# EAGLE design shield_bigfpga (EAGLE 9.1.1)
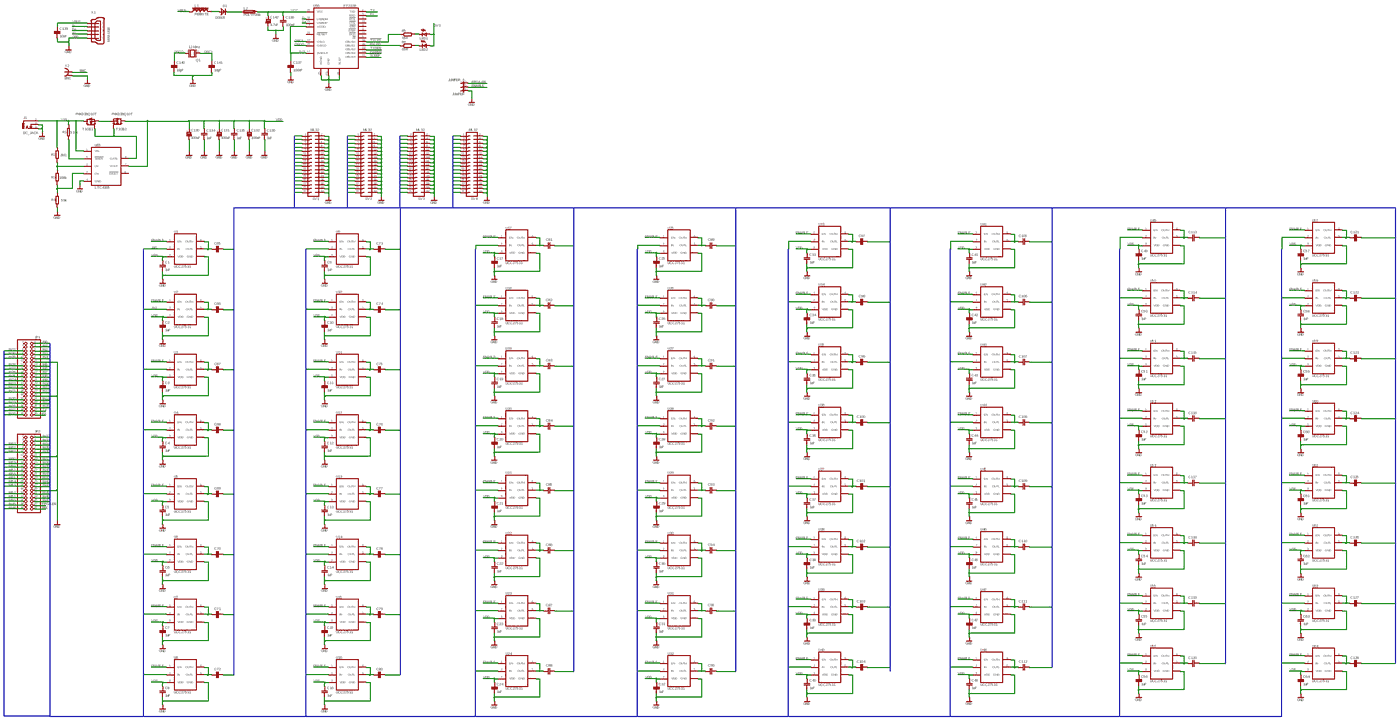
[diagram p0: schematic, sheet 1, overview]
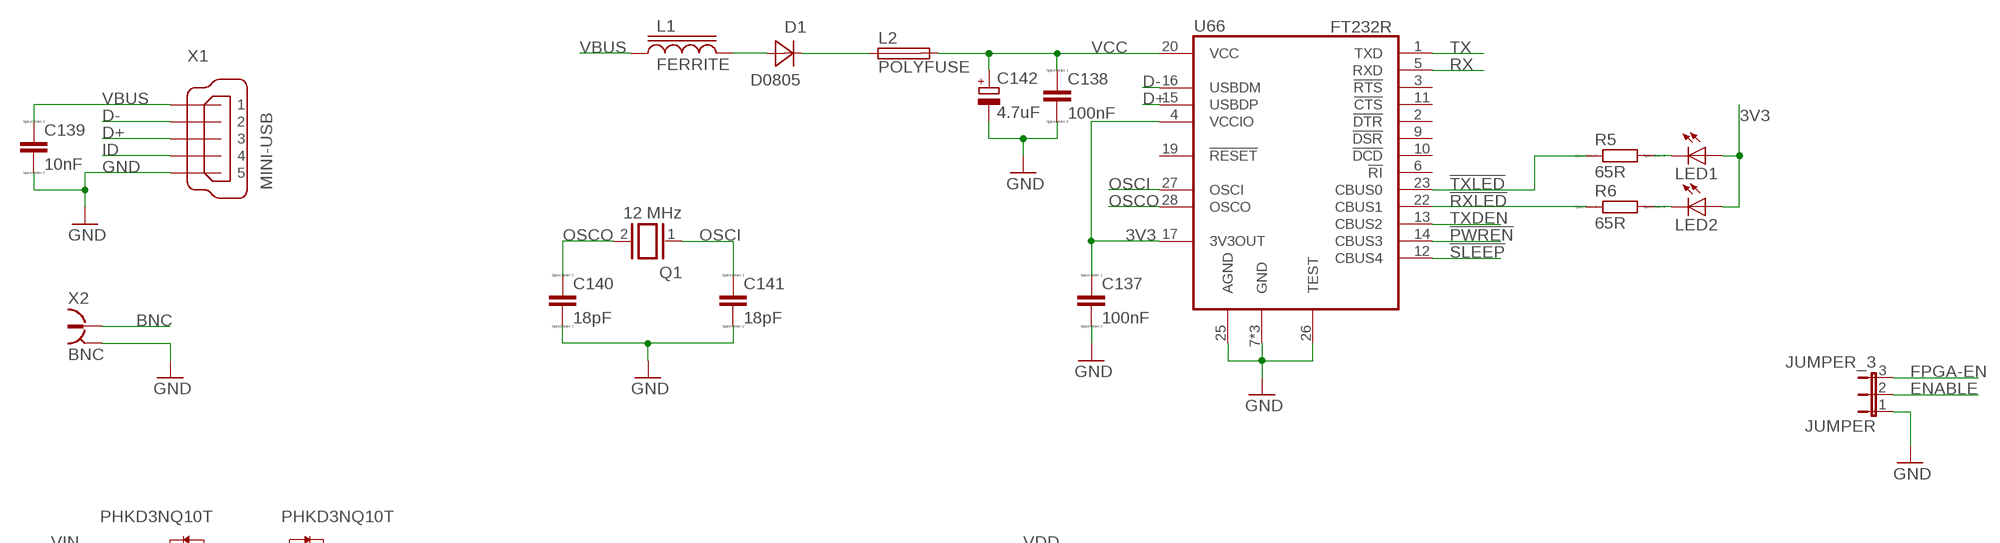
[diagram p1: schematic, sheet 1, part 1 of 4]
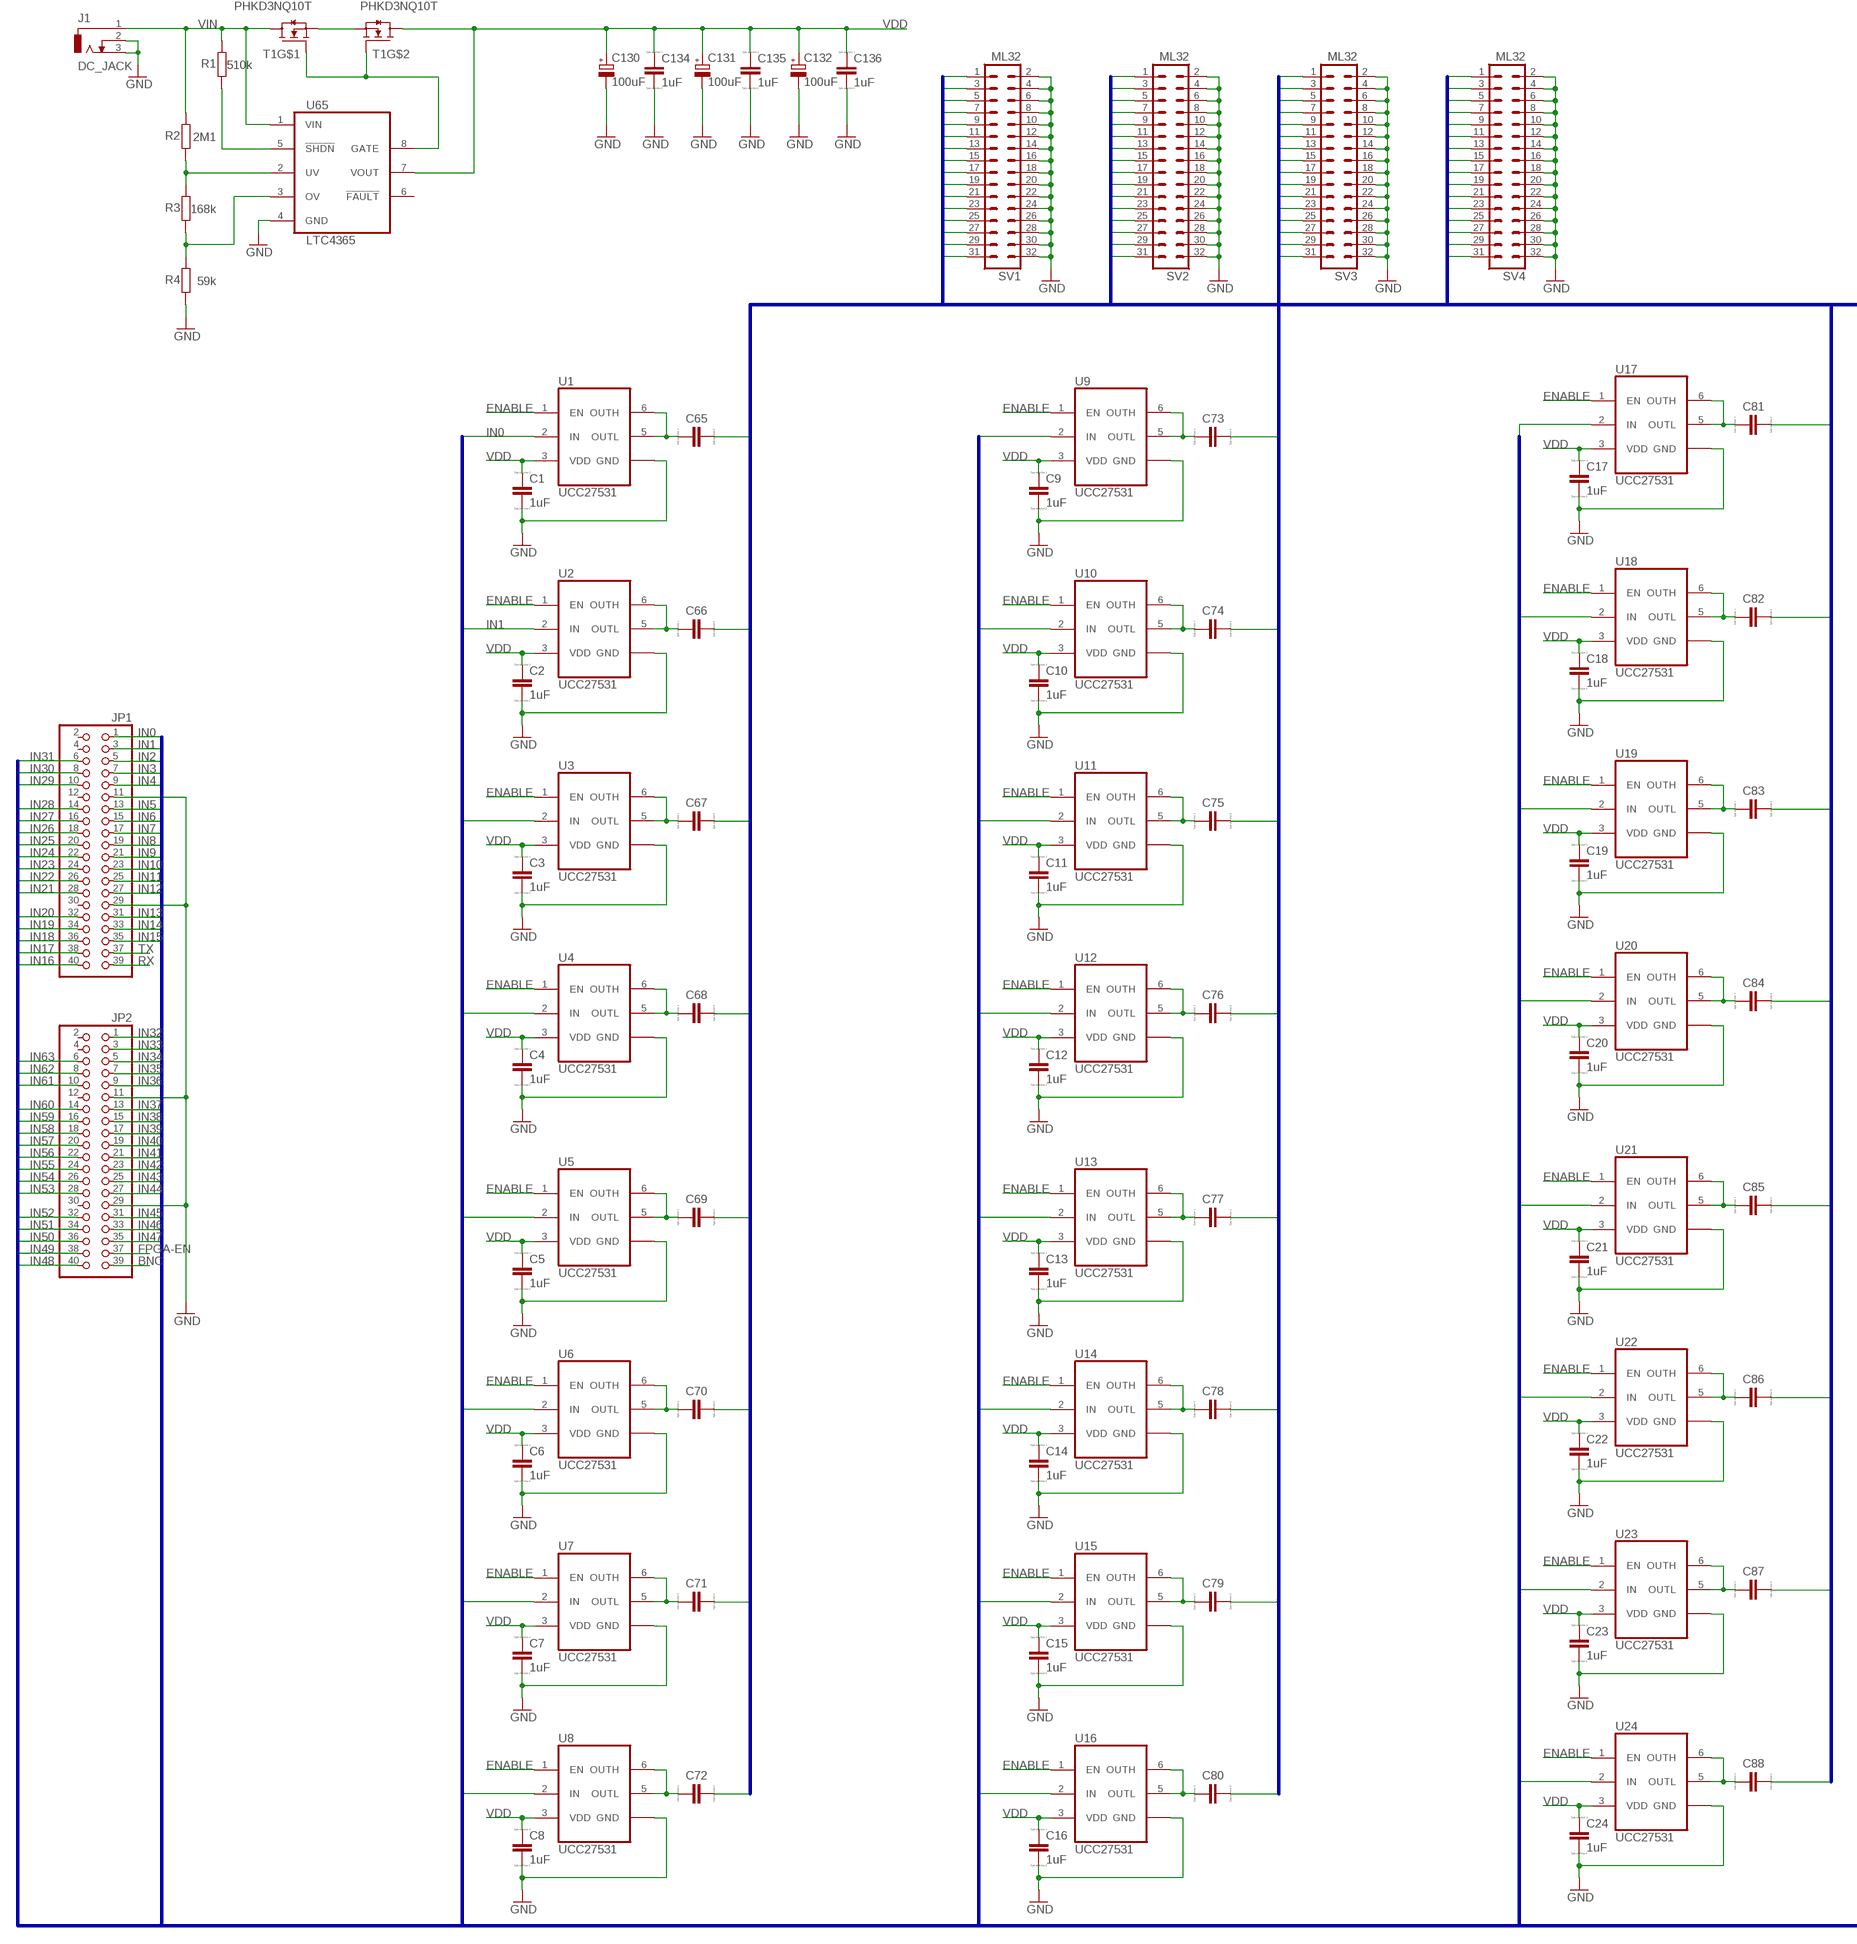
[diagram p2: schematic, sheet 1, part 2 of 4]
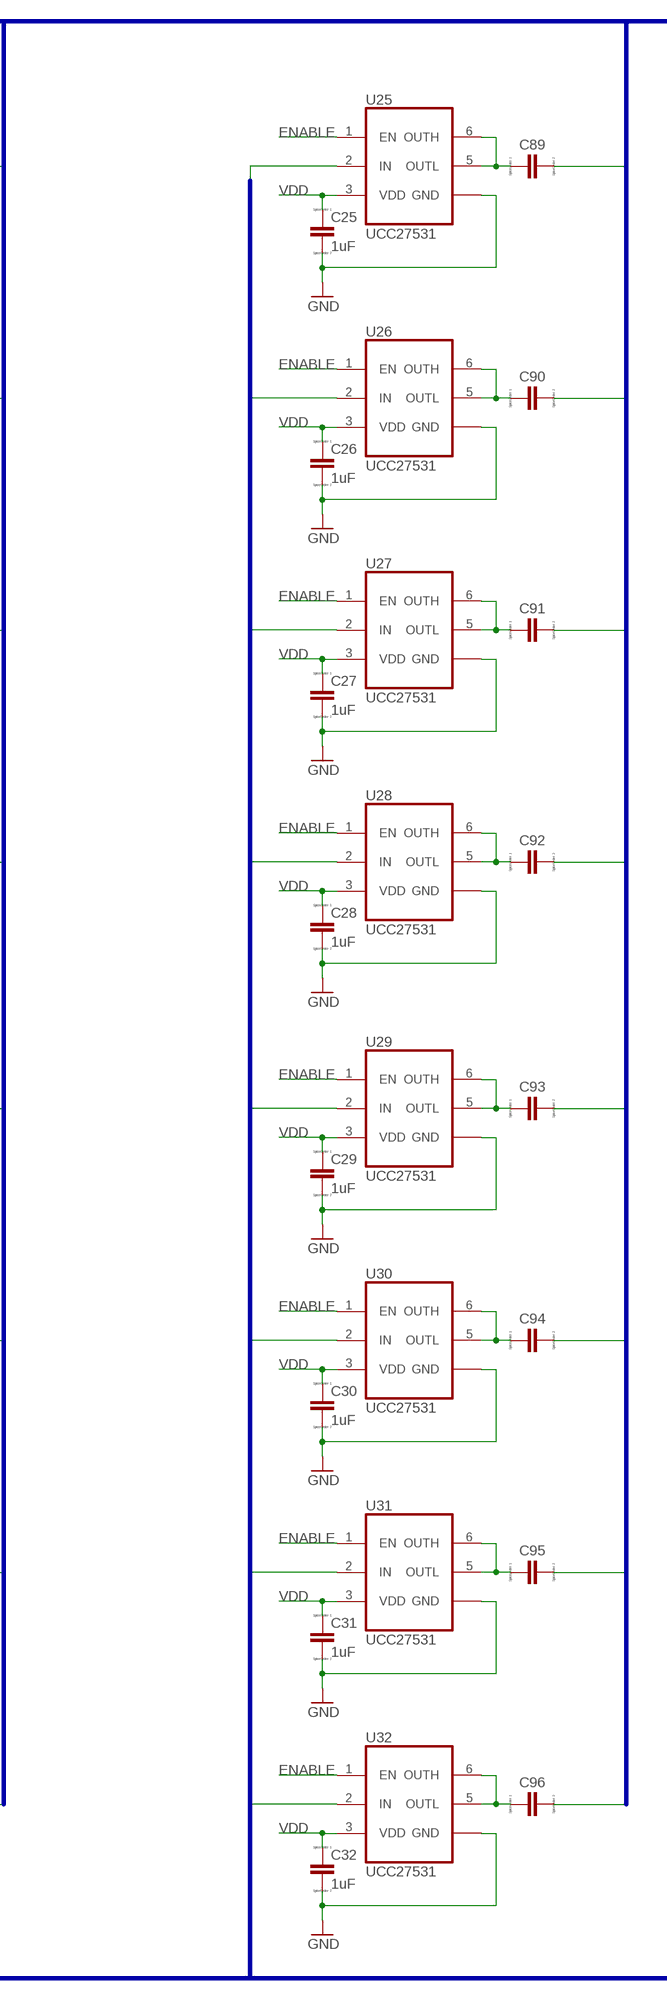
[diagram p3: schematic, sheet 1, part 3 of 4]
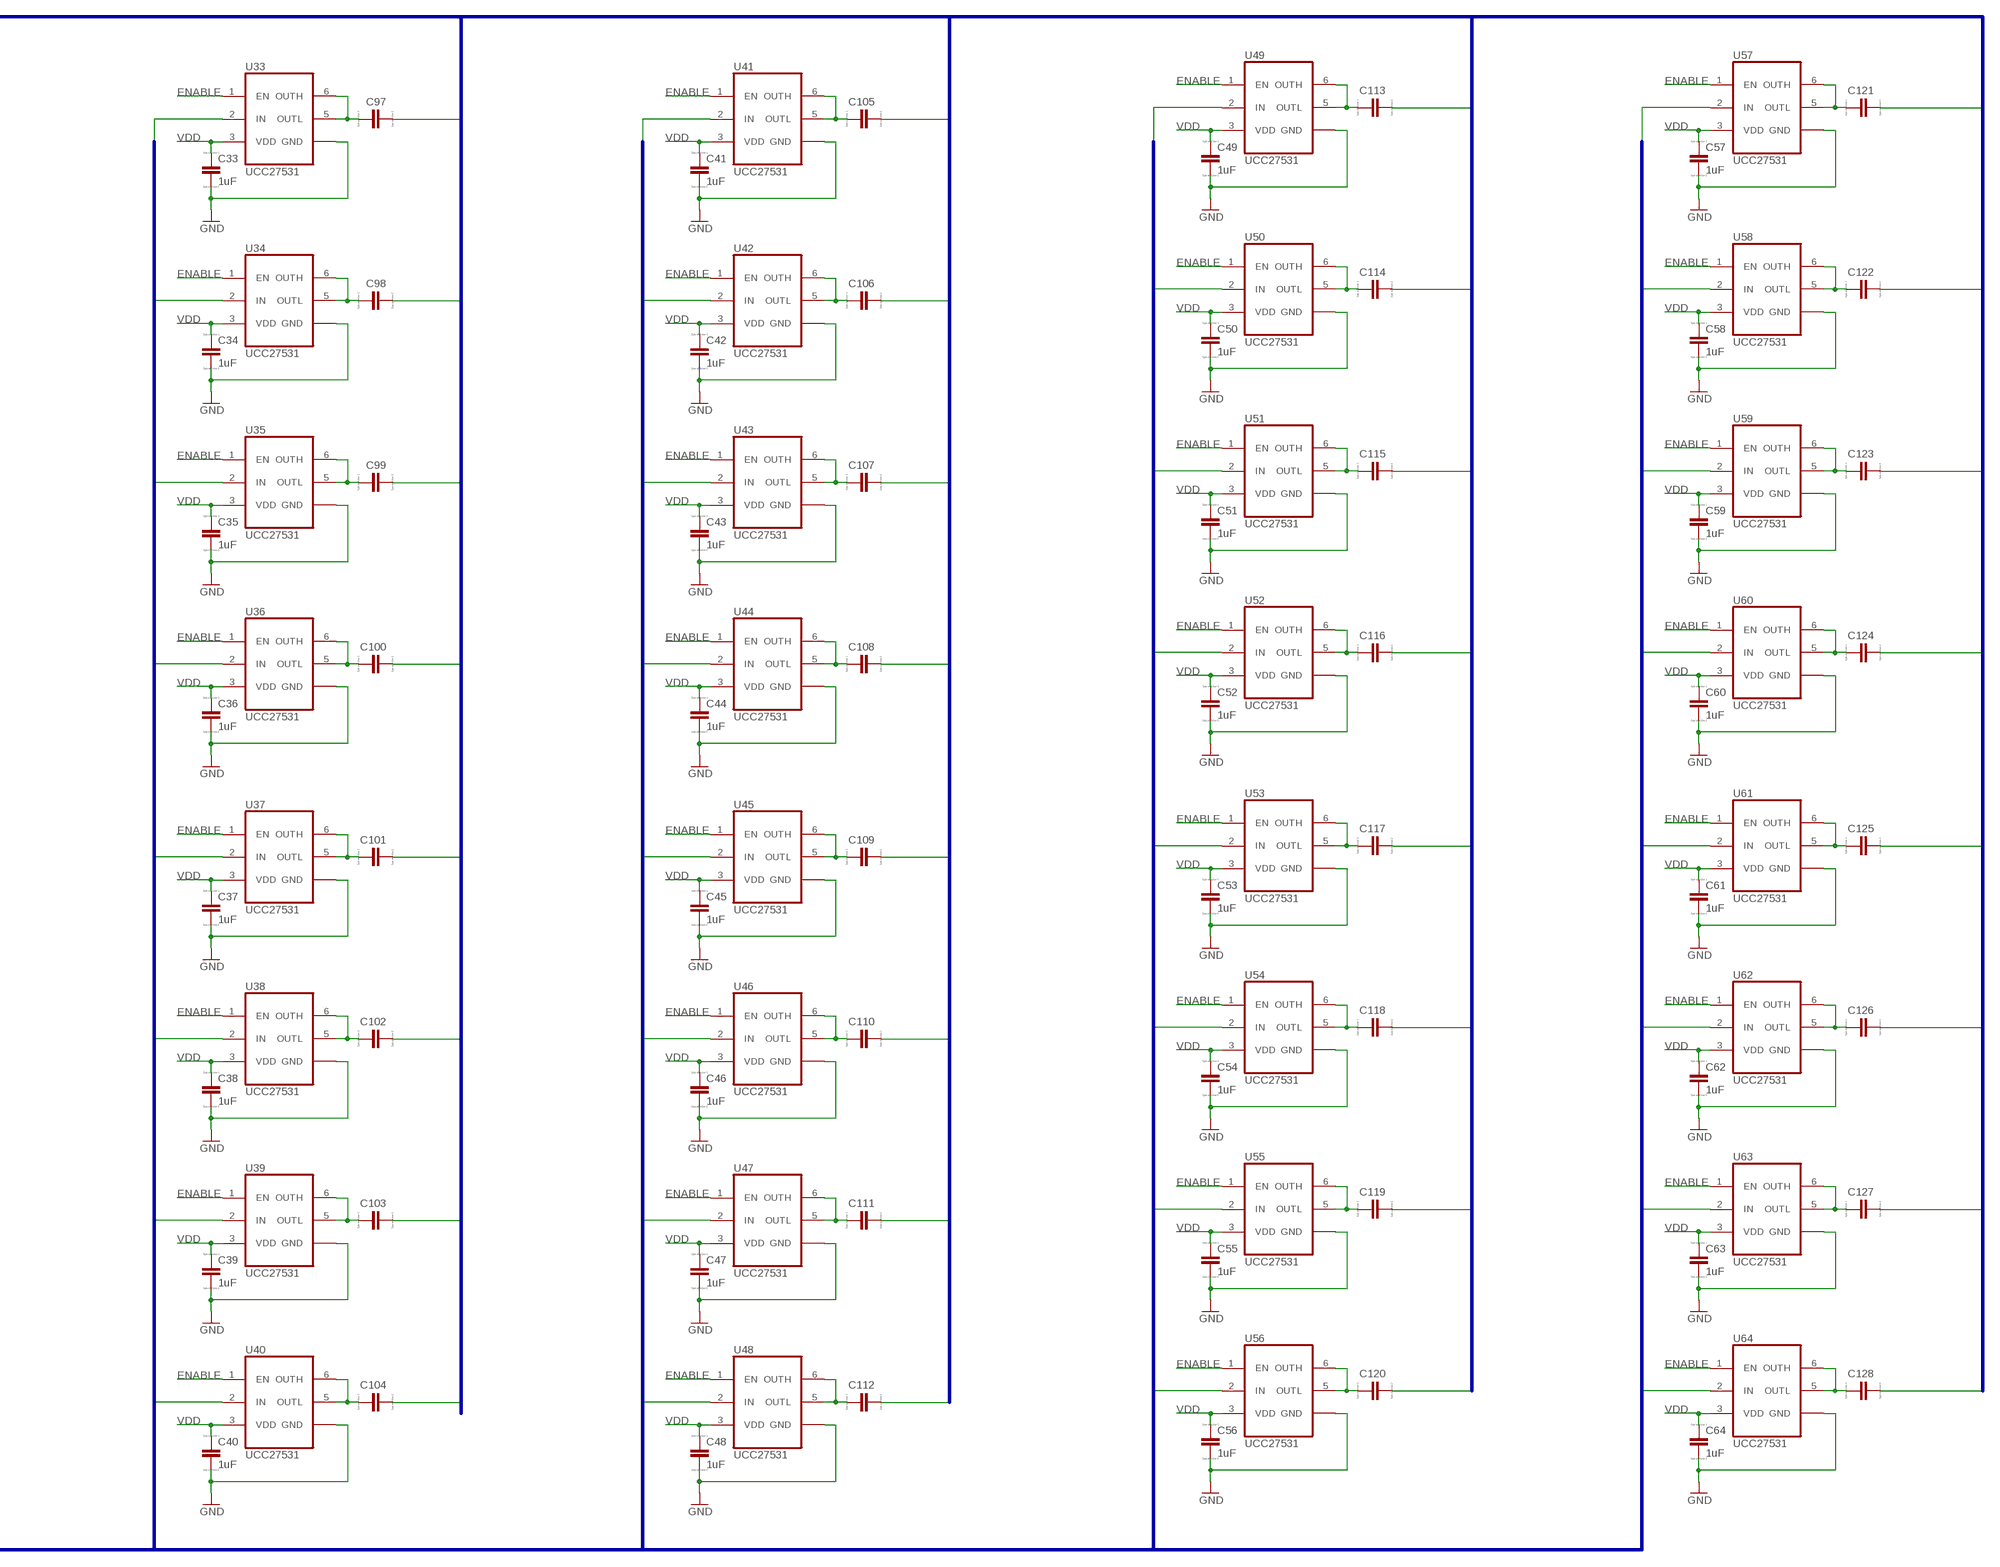
[diagram p4: schematic, sheet 1, part 4 of 4]

## Parts
C1  1uF  C  [C0805]
C2  1uF  C  [C0805]
C3  1uF  C  [C0805]
C4  1uF  C  [C0805]
C5  1uF  C  [C0805]
C6  1uF  C  [C0805]
C7  1uF  C  [C0805]
C8  1uF  C  [C0805]
C9  1uF  C  [C0805]
C10  1uF  C  [C0805]
C11  1uF  C  [C0805]
C12  1uF  C  [C0805]
C13  1uF  C  [C0805]
C14  1uF  C  [C0805]
C15  1uF  C  [C0805]
C16  1uF  C  [C0805]
C17  1uF  C  [C0805]
C18  1uF  C  [C0805]
C19  1uF  C  [C0805]
C20  1uF  C  [C0805]
C21  1uF  C  [C0805]
C22  1uF  C  [C0805]
C23  1uF  C  [C0805]
C24  1uF  C  [C0805]
C25  1uF  C  [C0805]
C26  1uF  C  [C0805]
C27  1uF  C  [C0805]
C28  1uF  C  [C0805]
C29  1uF  C  [C0805]
C30  1uF  C  [C0805]
C31  1uF  C  [C0805]
C32  1uF  C  [C0805]
C33  1uF  C  [C0805]
C34  1uF  C  [C0805]
C35  1uF  C  [C0805]
C36  1uF  C  [C0805]
C37  1uF  C  [C0805]
C38  1uF  C  [C0805]
C39  1uF  C  [C0805]
C40  1uF  C  [C0805]
C41  1uF  C  [C0805]
C42  1uF  C  [C0805]
C43  1uF  C  [C0805]
C44  1uF  C  [C0805]
C45  1uF  C  [C0805]
C46  1uF  C  [C0805]
C47  1uF  C  [C0805]
C48  1uF  C  [C0805]
C49  1uF  C  [C0805]
C50  1uF  C  [C0805]
C51  1uF  C  [C0805]
C52  1uF  C  [C0805]
C53  1uF  C  [C0805]
C54  1uF  C  [C0805]
C55  1uF  C  [C0805]
C56  1uF  C  [C0805]
C57  1uF  C  [C0805]
C58  1uF  C  [C0805]
C59  1uF  C  [C0805]
C60  1uF  C  [C0805]
C61  1uF  C  [C0805]
C62  1uF  C  [C0805]
C63  1uF  C  [C0805]
C64  1uF  C  [C0805]
C65  C  [C0805]
C66  C  [C0805]
C67  C  [C0805]
C68  C  [C0805]
C69  C  [C0805]
C70  C  [C0805]
C71  C  [C0805]
C72  C  [C0805]
C73  C  [C0805]
C74  C  [C0805]
C75  C  [C0805]
C76  C  [C0805]
C77  C  [C0805]
C78  C  [C0805]
C79  C  [C0805]
C80  C  [C0805]
C81  C  [C0805]
C82  C  [C0805]
C83  C  [C0805]
C84  C  [C0805]
C85  C  [C0805]
C86  C  [C0805]
C87  C  [C0805]
C88  C  [C0805]
C89  C  [C0805]
C90  C  [C0805]
C91  C  [C0805]
C92  C  [C0805]
C93  C  [C0805]
C94  C  [C0805]
C95  C  [C0805]
C96  C  [C0805]
C97  C  [C0805]
C98  C  [C0805]
C99  C  [C0805]
C100  C  [C0805]
C101  C  [C0805]
C102  C  [C0805]
C103  C  [C0805]
C104  C  [C0805]
C105  C  [C0805]
C106  C  [C0805]
C107  C  [C0805]
C108  C  [C0805]
C109  C  [C0805]
C110  C  [C0805]
C111  C  [C0805]
C112  C  [C0805]
C113  C  [C0805]
C114  C  [C0805]
C115  C  [C0805]
C116  C  [C0805]
C117  C  [C0805]
C118  C  [C0805]
C119  C  [C0805]
C120  C  [C0805]
C121  C  [C0805]
C122  C  [C0805]
C123  C  [C0805]
C124  C  [C0805]
C125  C  [C0805]
C126  C  [C0805]
C127  C  [C0805]
C128  C  [C0805]
C130  100uF  CPOL-EUE5-10.5  [E5-10,5]
C131  100uF  CPOL-EUE5-10.5  [E5-10,5]
C132  100uF  CPOL-EUE5-10.5  [E5-10,5]
C134  1uF  C  [C0805]
C135  1uF  C  [C0805]
C136  1uF  C  [C0805]
C137  100nF  C  [C0805]
C138  100nF  C  [C0805]
C139  10nF  C  [C0805]
C140  18pF  C  [C0805]
C141  18pF  C  [C0805]
C142  4.7uF  CPOL-EUE2.5-6  [E2,5-6]
D1  D0805  [D0805]
J1  DC_JACK  [DCJ0202]
JP1  PINHD-2X20  [2X20]
JP2  PINHD-2X20  [2X20]
JUMPER  JUMPER_3  [JP2]
L1  FERRITE  [SML0805]
L2  POLYFUSE  [SML0805]
LED1  LEDSML1206  [SML1206]
LED2  LEDSML1206  [SML1206]
Q1  12 MHz  XTAL/S  [QS]
R1  510k  R-EU_R0805  [R0805]
R2  2M1  R-EU_R0805  [R0805]
R3  168k  R-EU_R0805  [R0805]
R4  59k  R-EU_R0805  [R0805]
R5  65R  R  [R0805]
R6  65R  R  [R0805]
SV1  ML32  [ML32]
SV2  ML32  [ML32]
SV3  ML32  [ML32]
SV4  ML32  [ML32]
T1  PHKD3NQ10T  [SO8]
U1  UCC27531  [DBV_R-PDSO-G6]
U2  UCC27531  [DBV_R-PDSO-G6]
U3  UCC27531  [DBV_R-PDSO-G6]
U4  UCC27531  [DBV_R-PDSO-G6]
U5  UCC27531  [DBV_R-PDSO-G6]
U6  UCC27531  [DBV_R-PDSO-G6]
U7  UCC27531  [DBV_R-PDSO-G6]
U8  UCC27531  [DBV_R-PDSO-G6]
U9  UCC27531  [DBV_R-PDSO-G6]
U10  UCC27531  [DBV_R-PDSO-G6]
U11  UCC27531  [DBV_R-PDSO-G6]
U12  UCC27531  [DBV_R-PDSO-G6]
U13  UCC27531  [DBV_R-PDSO-G6]
U14  UCC27531  [DBV_R-PDSO-G6]
U15  UCC27531  [DBV_R-PDSO-G6]
U16  UCC27531  [DBV_R-PDSO-G6]
U17  UCC27531  [DBV_R-PDSO-G6]
U18  UCC27531  [DBV_R-PDSO-G6]
U19  UCC27531  [DBV_R-PDSO-G6]
U20  UCC27531  [DBV_R-PDSO-G6]
U21  UCC27531  [DBV_R-PDSO-G6]
U22  UCC27531  [DBV_R-PDSO-G6]
U23  UCC27531  [DBV_R-PDSO-G6]
U24  UCC27531  [DBV_R-PDSO-G6]
U25  UCC27531  [DBV_R-PDSO-G6]
U26  UCC27531  [DBV_R-PDSO-G6]
U27  UCC27531  [DBV_R-PDSO-G6]
U28  UCC27531  [DBV_R-PDSO-G6]
U29  UCC27531  [DBV_R-PDSO-G6]
U30  UCC27531  [DBV_R-PDSO-G6]
U31  UCC27531  [DBV_R-PDSO-G6]
U32  UCC27531  [DBV_R-PDSO-G6]
U33  UCC27531  [DBV_R-PDSO-G6]
U34  UCC27531  [DBV_R-PDSO-G6]
U35  UCC27531  [DBV_R-PDSO-G6]
U36  UCC27531  [DBV_R-PDSO-G6]
U37  UCC27531  [DBV_R-PDSO-G6]
U38  UCC27531  [DBV_R-PDSO-G6]
U39  UCC27531  [DBV_R-PDSO-G6]
U40  UCC27531  [DBV_R-PDSO-G6]
U41  UCC27531  [DBV_R-PDSO-G6]
U42  UCC27531  [DBV_R-PDSO-G6]
U43  UCC27531  [DBV_R-PDSO-G6]
U44  UCC27531  [DBV_R-PDSO-G6]
U45  UCC27531  [DBV_R-PDSO-G6]
U46  UCC27531  [DBV_R-PDSO-G6]
U47  UCC27531  [DBV_R-PDSO-G6]
U48  UCC27531  [DBV_R-PDSO-G6]
U49  UCC27531  [DBV_R-PDSO-G6]
U50  UCC27531  [DBV_R-PDSO-G6]
U51  UCC27531  [DBV_R-PDSO-G6]
U52  UCC27531  [DBV_R-PDSO-G6]
U53  UCC27531  [DBV_R-PDSO-G6]
U54  UCC27531  [DBV_R-PDSO-G6]
U55  UCC27531  [DBV_R-PDSO-G6]
U56  UCC27531  [DBV_R-PDSO-G6]
U57  UCC27531  [DBV_R-PDSO-G6]
U58  UCC27531  [DBV_R-PDSO-G6]
U59  UCC27531  [DBV_R-PDSO-G6]
U60  UCC27531  [DBV_R-PDSO-G6]
U61  UCC27531  [DBV_R-PDSO-G6]
U62  UCC27531  [DBV_R-PDSO-G6]
U63  UCC27531  [DBV_R-PDSO-G6]
U64  UCC27531  [DBV_R-PDSO-G6]
U65  LTC4365  [TSOT23-8]
U66  FT232R  [SSOP28]
X1  MINI-USB  MINI_USB  [32005-201]
X2  BNC  [BNC_CUSTOM]

## Nets
3V3: C137.1 LED1.A LED2.A U66.4(VCCIO) U66.17(3V3OUT)
!PWREN!: U66.14(CBUS3)
!RXLED!: R6.1 U66.22(CBUS1)
!SLEEP!: U66.12(CBUS4)
!TXLED!: R5.1 U66.23(CBUS0)
BNC: JP2.39 X2.1
D+: U66.15(USBDP) X1.3
D-: U66.16(USBDM) X1.2
ENABLE: JUMPER.2 U1.1(EN) U2.1(EN) U3.1(EN) U4.1(EN) U5.1(EN) U6.1(EN) U7.1(EN) U8.1(EN) U9.1(EN) U10.1(EN) U11.1(EN) U12.1(EN) U13.1(EN) U14.1(EN) U15.1(EN) U16.1(EN) U17.1(EN) U18.1(EN) U19.1(EN) U20.1(EN) U21.1(EN) U22.1(EN) U23.1(EN) U24.1(EN) U25.1(EN) U26.1(EN) U27.1(EN) U28.1(EN) U29.1(EN) U30.1(EN) U31.1(EN) U32.1(EN) U33.1(EN) U34.1(EN) U35.1(EN) U36.1(EN) U37.1(EN) U38.1(EN) U39.1(EN) U40.1(EN) U41.1(EN) U42.1(EN) U43.1(EN) U44.1(EN) U45.1(EN) U46.1(EN) U47.1(EN) U48.1(EN) U49.1(EN) U50.1(EN) U51.1(EN) U52.1(EN) U53.1(EN) U54.1(EN) U55.1(EN) U56.1(EN) U57.1(EN) U58.1(EN) U59.1(EN) U60.1(EN) U61.1(EN) U62.1(EN) U63.1(EN) U64.1(EN)
FPGA-EN: JP2.37 JUMPER.3
GND: C1.2 C2.2 C3.2 C4.2 C5.2 C6.2 C7.2 C8.2 C9.2 C10.2 C11.2 C12.2 C13.2 C14.2 C15.2 C16.2 C17.2 C18.2 C19.2 C20.2 C21.2 C22.2 C23.2 C24.2 C25.2 C26.2 C27.2 C28.2 C29.2 C30.2 C31.2 C32.2 C33.2 C34.2 C35.2 C36.2 C37.2 C38.2 C39.2 C40.2 C41.2 C42.2 C43.2 C44.2 C45.2 C46.2 C47.2 C48.2 C49.2 C50.2 C51.2 C52.2 C53.2 C54.2 C55.2 C56.2 C57.2 C58.2 C59.2 C60.2 C61.2 C62.2 C63.2 C64.2 C130.- C131.- C132.- C134.2 C135.2 C136.2 C137.2 C138.2 C139.2 C140.2 C141.2 C142.- J1.2 J1.3 JP1.11 JP1.29 JP2.11 JP2.29 JUMPER.1 R4.1 SV1.2 SV1.4 SV1.6 SV1.8 SV1.10 SV1.12 SV1.14 SV1.16 SV1.18 SV1.20 SV1.22 SV1.24 SV1.26 SV1.28 SV1.30 SV1.32 SV2.2 SV2.4 SV2.6 SV2.8 SV2.10 SV2.12 SV2.14 SV2.16 SV2.18 SV2.20 SV2.22 SV2.24 SV2.26 SV2.28 SV2.30 SV2.32 SV3.2 SV3.4 SV3.6 SV3.8 SV3.10 SV3.12 SV3.14 SV3.16 SV3.18 SV3.20 SV3.22 SV3.24 SV3.26 SV3.28 SV3.30 SV3.32 SV4.2 SV4.4 SV4.6 SV4.8 SV4.10 SV4.12 SV4.14 SV4.16 SV4.18 SV4.20 SV4.22 SV4.24 SV4.26 SV4.28 SV4.30 SV4.32 U1.4(GND) U2.4(GND) U3.4(GND) U4.4(GND) U5.4(GND) U6.4(GND) U7.4(GND) U8.4(GND) U9.4(GND) U10.4(GND) U11.4(GND) U12.4(GND) U13.4(GND) U14.4(GND) U15.4(GND) U16.4(GND) U17.4(GND) U18.4(GND) U19.4(GND) U20.4(GND) U21.4(GND) U22.4(GND) U23.4(GND) U24.4(GND) U25.4(GND) U26.4(GND) U27.4(GND) U28.4(GND) U29.4(GND) U30.4(GND) U31.4(GND) U32.4(GND) U33.4(GND) U34.4(GND) U35.4(GND) U36.4(GND) U37.4(GND) U38.4(GND) U39.4(GND) U40.4(GND) U41.4(GND) U42.4(GND) U43.4(GND) U44.4(GND) U45.4(GND) U46.4(GND) U47.4(GND) U48.4(GND) U49.4(GND) U50.4(GND) U51.4(GND) U52.4(GND) U53.4(GND) U54.4(GND) U55.4(GND) U56.4(GND) U57.4(GND) U58.4(GND) U59.4(GND) U60.4(GND) U61.4(GND) U62.4(GND) U63.4(GND) U64.4(GND) U65.4(GND) U66.7(GND) U66.18(GND) U66.21(GND) U66.25(AGND) U66.26(TEST) X1.5 X2.2
ID: X1.4
IN0: JP1.1 U1.2(IN)
IN1: JP1.3 U2.2(IN)
IN2: JP1.5 U3.2(IN)
IN3: JP1.7 U4.2(IN)
IN4: JP1.9 U5.2(IN)
IN5: JP1.13 U6.2(IN)
IN6: JP1.15 U7.2(IN)
IN7: JP1.17 U8.2(IN)
IN8: JP1.19 U9.2(IN)
IN9: JP1.21 U10.2(IN)
IN10: JP1.23 U11.2(IN)
IN11: JP1.25 U12.2(IN)
IN12: JP1.27 U13.2(IN)
IN13: JP1.31 U14.2(IN)
IN14: JP1.33 U15.2(IN)
IN15: JP1.35 U16.2(IN)
IN16: JP1.40 U17.2(IN)
IN17: JP1.38 U18.2(IN)
IN18: JP1.36 U19.2(IN)
IN19: JP1.34 U20.2(IN)
IN20: JP1.32 U21.2(IN)
IN21: JP1.28 U22.2(IN)
IN22: JP1.26 U23.2(IN)
IN23: JP1.24 U24.2(IN)
IN24: JP1.22 U25.2(IN)
IN25: JP1.20 U26.2(IN)
IN26: JP1.18 U27.2(IN)
IN27: JP1.16 U28.2(IN)
IN28: JP1.14 U29.2(IN)
IN29: JP1.10 U30.2(IN)
IN30: JP1.8 U31.2(IN)
IN31: JP1.6 U32.2(IN)
IN32: JP2.1 U33.2(IN)
IN33: JP2.3 U34.2(IN)
IN34: JP2.5 U35.2(IN)
IN35: JP2.7 U36.2(IN)
IN36: JP2.9 U37.2(IN)
IN37: JP2.13 U38.2(IN)
IN38: JP2.15 U39.2(IN)
IN39: JP2.17 U40.2(IN)
IN40: JP2.19 U41.2(IN)
IN41: JP2.21 U42.2(IN)
IN42: JP2.23 U43.2(IN)
IN43: JP2.25 U44.2(IN)
IN44: JP2.27 U45.2(IN)
IN45: JP2.31 U46.2(IN)
IN46: JP2.33 U47.2(IN)
IN47: JP2.35 U48.2(IN)
IN48: JP2.40 U49.2(IN)
IN49: JP2.38 U50.2(IN)
IN50: JP2.36 U51.2(IN)
IN51: JP2.34 U52.2(IN)
IN52: JP2.32 U53.2(IN)
IN53: JP2.28 U54.2(IN)
IN54: JP2.26 U55.2(IN)
IN55: JP2.24 U56.2(IN)
IN56: JP2.22 U57.2(IN)
IN57: JP2.20 U58.2(IN)
IN58: JP2.18 U59.2(IN)
IN59: JP2.16 U60.2(IN)
IN60: JP2.14 U61.2(IN)
IN61: JP2.10 U62.2(IN)
IN62: JP2.8 U63.2(IN)
IN63: JP2.6 U64.2(IN)
N$1: C65.1 U1.5(OUTL) U1.6(OUTH)
N$2: D1.N L2.A
N$3: D1.P L1.C
N$4: R1.1 U65.5(!SHDN!)
N$5: C66.1 U2.5(OUTL) U2.6(OUTH)
N$6: R2.1 R3.2 U65.2(UV)
N$7: R3.1 R4.2 U65.3(OV)
N$8: C67.1 U3.5(OUTL) U3.6(OUTH)
N$9: T1.1(S) T1.3(S)
N$10: T1.2(G) T1.4(G) U65.8(GATE)
N$11: C68.1 U4.5(OUTL) U4.6(OUTH)
N$12: LED1.C R5.2
N$13: LED2.C R6.2
N$14: C69.1 U5.5(OUTL) U5.6(OUTH)
N$17: C70.1 U6.5(OUTL) U6.6(OUTH)
N$20: C71.1 U7.5(OUTL) U7.6(OUTH)
N$23: C72.1 U8.5(OUTL) U8.6(OUTH)
N$26: C73.1 U9.5(OUTL) U9.6(OUTH)
N$29: C74.1 U10.5(OUTL) U10.6(OUTH)
N$32: C75.1 U11.5(OUTL) U11.6(OUTH)
N$35: C76.1 U12.5(OUTL) U12.6(OUTH)
N$38: C77.1 U13.5(OUTL) U13.6(OUTH)
N$41: C78.1 U14.5(OUTL) U14.6(OUTH)
N$44: C79.1 U15.5(OUTL) U15.6(OUTH)
N$47: C80.1 U16.5(OUTL) U16.6(OUTH)
N$50: C81.1 U17.5(OUTL) U17.6(OUTH)
N$53: C82.1 U18.5(OUTL) U18.6(OUTH)
N$56: C83.1 U19.5(OUTL) U19.6(OUTH)
N$59: C84.1 U20.5(OUTL) U20.6(OUTH)
N$62: C85.1 U21.5(OUTL) U21.6(OUTH)
N$65: C86.1 U22.5(OUTL) U22.6(OUTH)
N$68: C87.1 U23.5(OUTL) U23.6(OUTH)
N$71: C88.1 U24.5(OUTL) U24.6(OUTH)
N$74: C89.1 U25.5(OUTL) U25.6(OUTH)
N$77: C90.1 U26.5(OUTL) U26.6(OUTH)
N$80: C91.1 U27.5(OUTL) U27.6(OUTH)
N$83: C92.1 U28.5(OUTL) U28.6(OUTH)
N$86: C93.1 U29.5(OUTL) U29.6(OUTH)
N$89: C94.1 U30.5(OUTL) U30.6(OUTH)
N$92: C95.1 U31.5(OUTL) U31.6(OUTH)
N$95: C96.1 U32.5(OUTL) U32.6(OUTH)
N$98: C97.1 U33.5(OUTL) U33.6(OUTH)
N$101: C98.1 U34.5(OUTL) U34.6(OUTH)
N$104: C99.1 U35.5(OUTL) U35.6(OUTH)
N$107: C100.1 U36.5(OUTL) U36.6(OUTH)
N$110: C101.1 U37.5(OUTL) U37.6(OUTH)
N$113: C102.1 U38.5(OUTL) U38.6(OUTH)
N$116: C103.1 U39.5(OUTL) U39.6(OUTH)
N$119: C104.1 U40.5(OUTL) U40.6(OUTH)
N$122: C105.1 U41.5(OUTL) U41.6(OUTH)
N$125: C106.1 U42.5(OUTL) U42.6(OUTH)
N$128: C107.1 U43.5(OUTL) U43.6(OUTH)
N$131: C108.1 U44.5(OUTL) U44.6(OUTH)
N$134: C109.1 U45.5(OUTL) U45.6(OUTH)
N$137: C110.1 U46.5(OUTL) U46.6(OUTH)
N$140: C111.1 U47.5(OUTL) U47.6(OUTH)
N$143: C112.1 U48.5(OUTL) U48.6(OUTH)
N$146: C113.1 U49.5(OUTL) U49.6(OUTH)
N$149: C114.1 U50.5(OUTL) U50.6(OUTH)
N$152: C115.1 U51.5(OUTL) U51.6(OUTH)
N$155: C116.1 U52.5(OUTL) U52.6(OUTH)
N$158: C117.1 U53.5(OUTL) U53.6(OUTH)
N$161: C118.1 U54.5(OUTL) U54.6(OUTH)
N$164: C119.1 U55.5(OUTL) U55.6(OUTH)
N$167: C120.1 U56.5(OUTL) U56.6(OUTH)
N$170: C121.1 U57.5(OUTL) U57.6(OUTH)
N$173: C122.1 U58.5(OUTL) U58.6(OUTH)
N$176: C123.1 U59.5(OUTL) U59.6(OUTH)
N$179: C124.1 U60.5(OUTL) U60.6(OUTH)
N$182: C125.1 U61.5(OUTL) U61.6(OUTH)
N$185: C126.1 U62.5(OUTL) U62.6(OUTH)
N$188: C127.1 U63.5(OUTL) U63.6(OUTH)
N$191: C128.1 U64.5(OUTL) U64.6(OUTH)
OSCI: C141.1 Q1.1 U66.27(OSCI)
OSCO: C140.1 Q1.2 U66.28(OSCO)
OUT0: C65.2 SV1.1
OUT1: C66.2 SV1.3
OUT2: C67.2 SV1.5
OUT3: C68.2 SV1.7
OUT4: C69.2 SV1.9
OUT5: C70.2 SV1.11
OUT6: C71.2 SV1.13
OUT7: C72.2 SV1.15
OUT8: C73.2 SV1.17
OUT9: C74.2 SV1.19
OUT10: C75.2 SV1.21
OUT11: C76.2 SV1.23
OUT12: C77.2 SV1.25
OUT13: C78.2 SV1.27
OUT14: C79.2 SV1.29
OUT15: C80.2 SV1.31
OUT16: C81.2 SV2.1
OUT17: C82.2 SV2.3
OUT18: C83.2 SV2.5
OUT19: C84.2 SV2.7
OUT20: C85.2 SV2.9
OUT21: C86.2 SV2.11
OUT22: C87.2 SV2.13
OUT23: C88.2 SV2.15
OUT24: C89.2 SV2.17
OUT25: C90.2 SV2.19
OUT26: C91.2 SV2.21
OUT27: C92.2 SV2.23
OUT28: C93.2 SV2.25
OUT29: C94.2 SV2.27
OUT30: C95.2 SV2.29
OUT31: C96.2 SV2.31
OUT32: C97.2 SV3.1
OUT33: C98.2 SV3.3
OUT34: C99.2 SV3.5
OUT35: C100.2 SV3.7
OUT36: C101.2 SV3.9
OUT37: C102.2 SV3.11
OUT38: C103.2 SV3.13
OUT39: C104.2 SV3.15
OUT40: C105.2 SV3.17
OUT41: C106.2 SV3.19
OUT42: C107.2 SV3.21
OUT43: C108.2 SV3.23
OUT44: C109.2 SV3.25
OUT45: C110.2 SV3.27
OUT46: C111.2 SV3.29
OUT47: C112.2 SV3.31
OUT48: C113.2 SV4.1
OUT49: C114.2 SV4.3
OUT50: C115.2 SV4.5
OUT51: C116.2 SV4.7
OUT52: C117.2 SV4.9
OUT53: C118.2 SV4.11
OUT54: C119.2 SV4.13
OUT55: C120.2 SV4.15
OUT56: C121.2 SV4.17
OUT57: C122.2 SV4.19
OUT58: C123.2 SV4.21
OUT59: C124.2 SV4.23
OUT60: C125.2 SV4.25
OUT61: C126.2 SV4.27
OUT62: C127.2 SV4.29
OUT63: C128.2 SV4.31
RX: JP1.39 U66.5(RXD)
TX: JP1.37 U66.1(TXD)
TXDEN: U66.13(CBUS2)
VBUS: C139.1 L1.A X1.1
VCC: C138.1 C142.+ L2.C U66.20(VCC)
VDD: C1.1 C2.1 C3.1 C4.1 C5.1 C6.1 C7.1 C8.1 C9.1 C10.1 C11.1 C12.1 C13.1 C14.1 C15.1 C16.1 C17.1 C18.1 C19.1 C20.1 C21.1 C22.1 C23.1 C24.1 C25.1 C26.1 C27.1 C28.1 C29.1 C30.1 C31.1 C32.1 C33.1 C34.1 C35.1 C36.1 C37.1 C38.1 C39.1 C40.1 C41.1 C42.1 C43.1 C44.1 C45.1 C46.1 C47.1 C48.1 C49.1 C50.1 C51.1 C52.1 C53.1 C54.1 C55.1 C56.1 C57.1 C58.1 C59.1 C60.1 C61.1 C62.1 C63.1 C64.1 C130.+ C131.+ C132.+ C134.1 C135.1 C136.1 T1.5(D) T1.6(D) U1.3(VDD) U2.3(VDD) U3.3(VDD) U4.3(VDD) U5.3(VDD) U6.3(VDD) U7.3(VDD) U8.3(VDD) U9.3(VDD) U10.3(VDD) U11.3(VDD) U12.3(VDD) U13.3(VDD) U14.3(VDD) U15.3(VDD) U16.3(VDD) U17.3(VDD) U18.3(VDD) U19.3(VDD) U20.3(VDD) U21.3(VDD) U22.3(VDD) U23.3(VDD) U24.3(VDD) U25.3(VDD) U26.3(VDD) U27.3(VDD) U28.3(VDD) U29.3(VDD) U30.3(VDD) U31.3(VDD) U32.3(VDD) U33.3(VDD) U34.3(VDD) U35.3(VDD) U36.3(VDD) U37.3(VDD) U38.3(VDD) U39.3(VDD) U40.3(VDD) U41.3(VDD) U42.3(VDD) U43.3(VDD) U44.3(VDD) U45.3(VDD) U46.3(VDD) U47.3(VDD) U48.3(VDD) U49.3(VDD) U50.3(VDD) U51.3(VDD) U52.3(VDD) U53.3(VDD) U54.3(VDD) U55.3(VDD) U56.3(VDD) U57.3(VDD) U58.3(VDD) U59.3(VDD) U60.3(VDD) U61.3(VDD) U62.3(VDD) U63.3(VDD) U64.3(VDD) U65.7(VOUT)
VIN: J1.1 R1.2 R2.2 T1.7(D) T1.8(D) U65.1(VIN)
Unconnected: JP1.2 JP1.4 JP1.12 JP1.30 JP2.2 JP2.4 JP2.12 JP2.30 U65.6(!FAULT!) U66.2(!DTR!) U66.3(!RTS!) U66.6(!RI!) U66.8(NC) U66.9(!DSR!) U66.10(!DCD!) U66.11(!CTS!) U66.19(!RESET!) U66.24(NC2)

## Buses
IN[0..63]
OUT[0..63]

## Library data of the parts
C1-C128 C134-C141 = eagle-ltspice:C: CAPACITOR, European symbol; SPICEMODEL: NONE; SPICEPREFIX: C
C130-C132 C142 = rcl:CPOL-EU: POLARIZED CAPACITOR, European symbol; SPICEPREFIX: C
D1 = shieldLibrary:D0805: DIODE SMD0805 Package
J1 = shieldLibrary:DC_JACK
JP1 JP2 = pinhead:PINHD-2X20: PIN HEADER
JUMPER = shieldLibrary:JUMPER_3
L1 = shieldLibrary:FERRITE
L2 = shieldLibrary:POLYFUSE
LED1 LED2 = led:LED: LED OSRAM: - CHIPLED LG R971, LG N971, LY N971, LG Q971, LY Q971, LO R971, LY R971 LH N974, LH R974 LS Q976, LO Q976, LY Q976 LO Q996 - Hyper CHIPLED LW Q18S LB Q993, LB Q99A, LB R99A - SideLED LS A670, LO A670, LY A670, LG A670, LP A670 LB A673, LV A673, LT A673, LW A673 LH A674 LY A675 LS A676, LA A676, LO A676, LY A676, LW A676 LS A679, LY A679, LG A679 - Hyper Micro SIDELED® LS Y876, LA Y876, LO Y876, LY Y876 LT Y87S - SmartLED LW L88C, LW L88S LB L89C, LB L89S, LG L890 LS L89K, LO L89K, LY L89K LS L896, LA L896, LO L896, LY L896 - TOPLED LS T670, LO T670, LY T670, LG T670, LP T670 LSG T670, LSP T670, LSY T670, LOP T670, LYG T670 LG T671, LOG T671, LSG T671 LB T673, LV T673, LT T673, LW T673 LH T674 LS T676, LA T676, LO T676, LY T676, LB T676, LH T676, LSB T676, LW T676 LB T67C, LV T67C, LT T67C, LS T67K, LO T67K, LY T67K, LW E67C LS E67B, LA E67B, LO E67B, LY E67B, LB E67C, LV E67C, LT E67C LW T67C LS T679, LY T679, LG T679 LS T770, LO T770, LY T770, LG T770, LP T770 LB T773, LV T773, LT T773, LW T773 LH T774 LS E675, LA E675, LY E675, LS T675 LS T776, LA T776, LO T776, LY T776, LB T776 LHGB T686 LT T68C, LB T68C - Hyper Mini TOPLED® LB M676 - Mini TOPLED Santana® LG M470 LS M47K, LO M47K, LY M47K Source: http://www.osram.convergy.de LUXEON: - LUMILED® LXK2-PW12-R00, LXK2-PW12-S00, LXK2-PW14-U00, LXK2-PW14-V00 LXK2-PM12-R00, LXK2-PM12-S00, LXK2-PM14-U00 LXK2-PE12-Q00, LXK2-PE12-R00, LXK2-PE12-S00, LXK2-PE14-T00, LXK2-PE14-U00 LXK2-PB12-K00, LXK2-PB12-L00, LXK2-PB12-M00, LXK2-PB14-N00, LXK2-PB14-P00, LXK2-PB14-Q00 LXK2-PR12-L00, LXK2-PR12-M00, LXK2-PR14-Q00, LXK2-PR14-R00 LXK2-PD12-Q00, LXK2-PD12-R00, LXK2-PD12-S00 LXK2-PH12-R00, LXK2-PH12-S00 LXK2-PL12-P00, LXK2-PL12-Q00, LXK2-PL12-R00 Source: www.luxeon.com KINGBRIGHT: KA-3528ASYC Source: www.kingbright.com
Q1 = special:XTAL/S: CRYSTAL
R1-R4 = resistor:R-EU_: RESISTOR, European symbol
R5 R6 = eagle-ltspice:R: RESISTOR, European symbol; SPICEMODEL: NONE; SPICEPREFIX: R
SV1-SV4 = shieldLibrary:ML32
T1 = shieldLibrary:PHKD3NQ10T: NXP Semiconductors Dual N-Channel MOSFET
U1-U64 = shieldLibrary:UCC27531
U65 = shieldLibrary:LTC4365
U66 = shieldLibrary:FT232R
X1 = shieldLibrary:MINI_USB
X2 = shieldLibrary:BNC

## Board
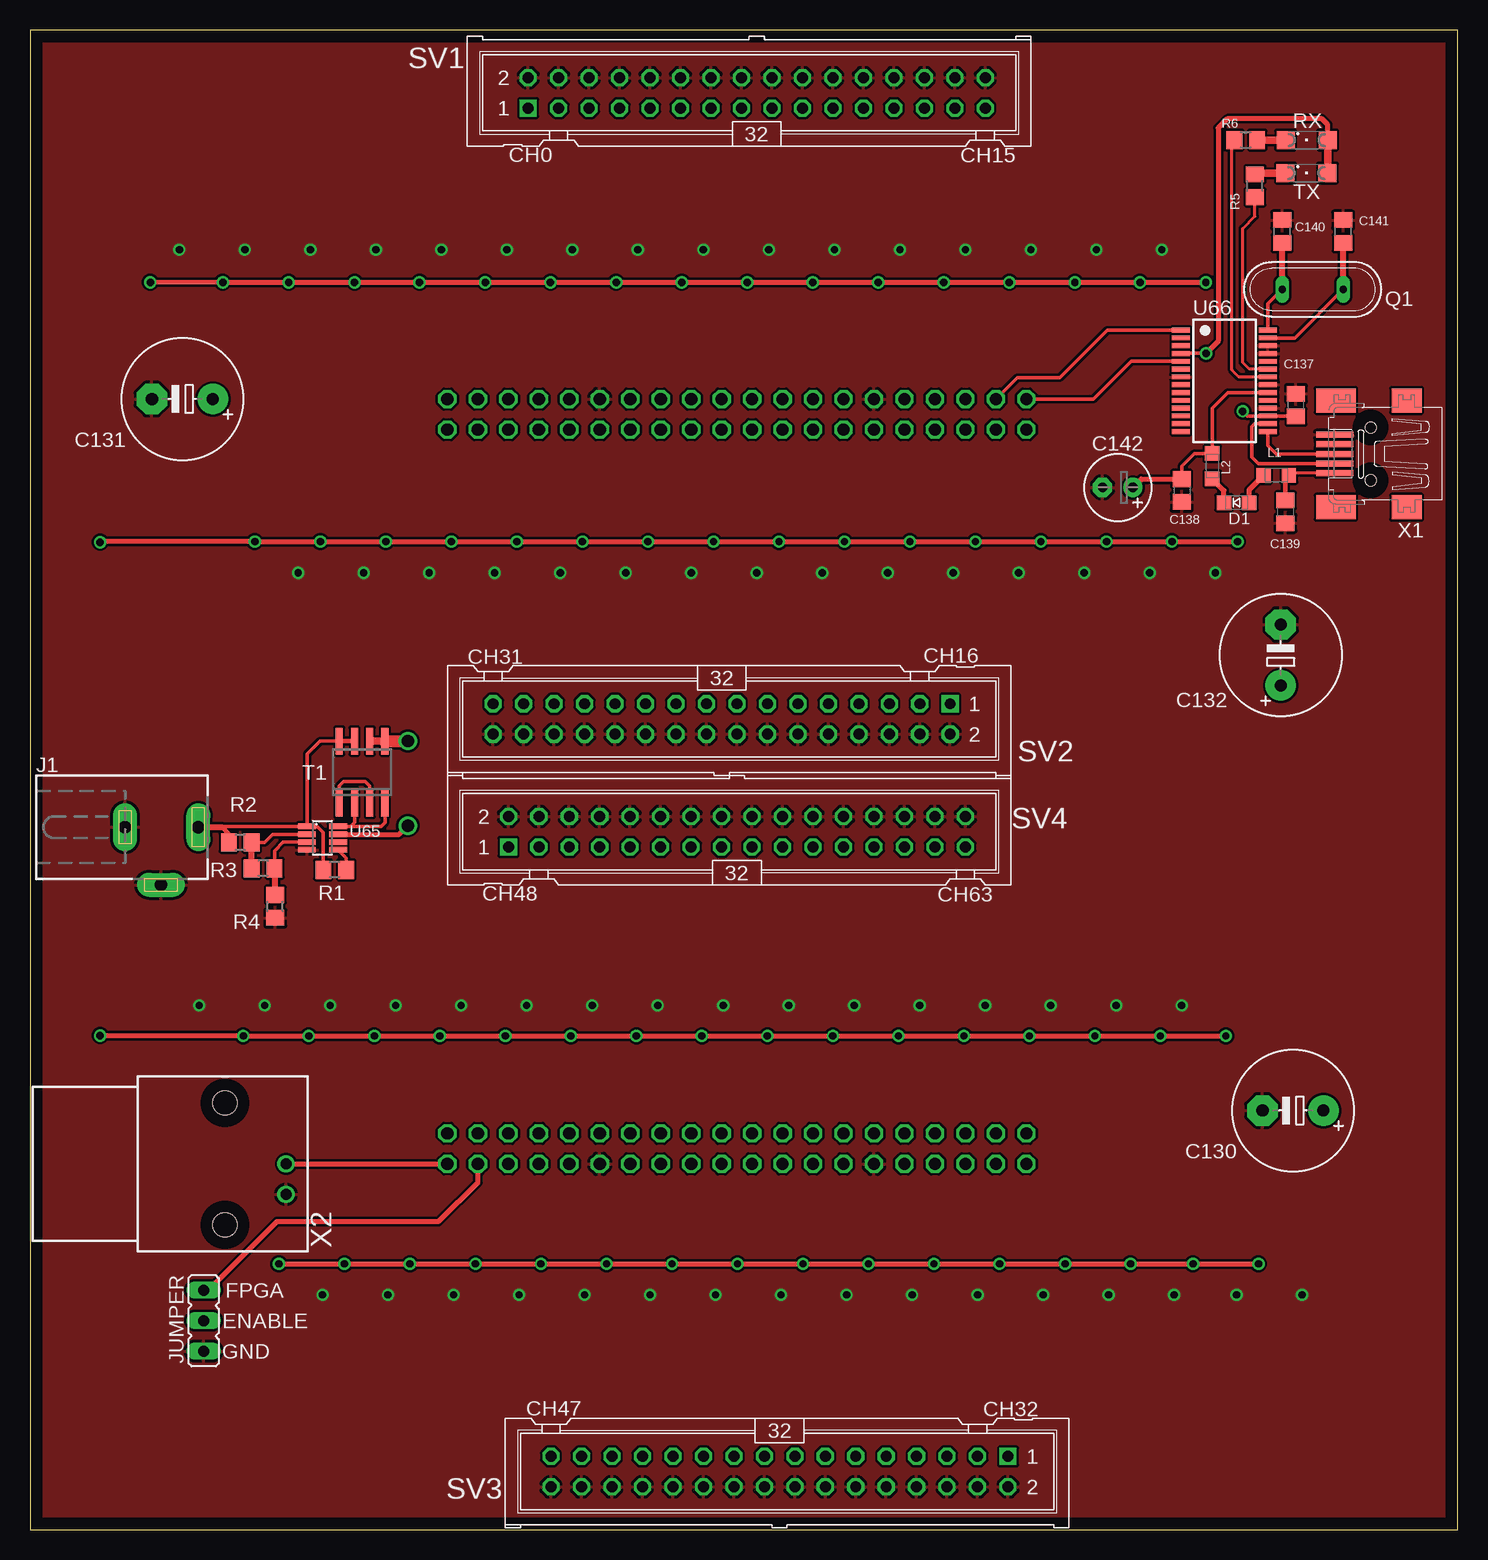
[diagram p5: board, top side]
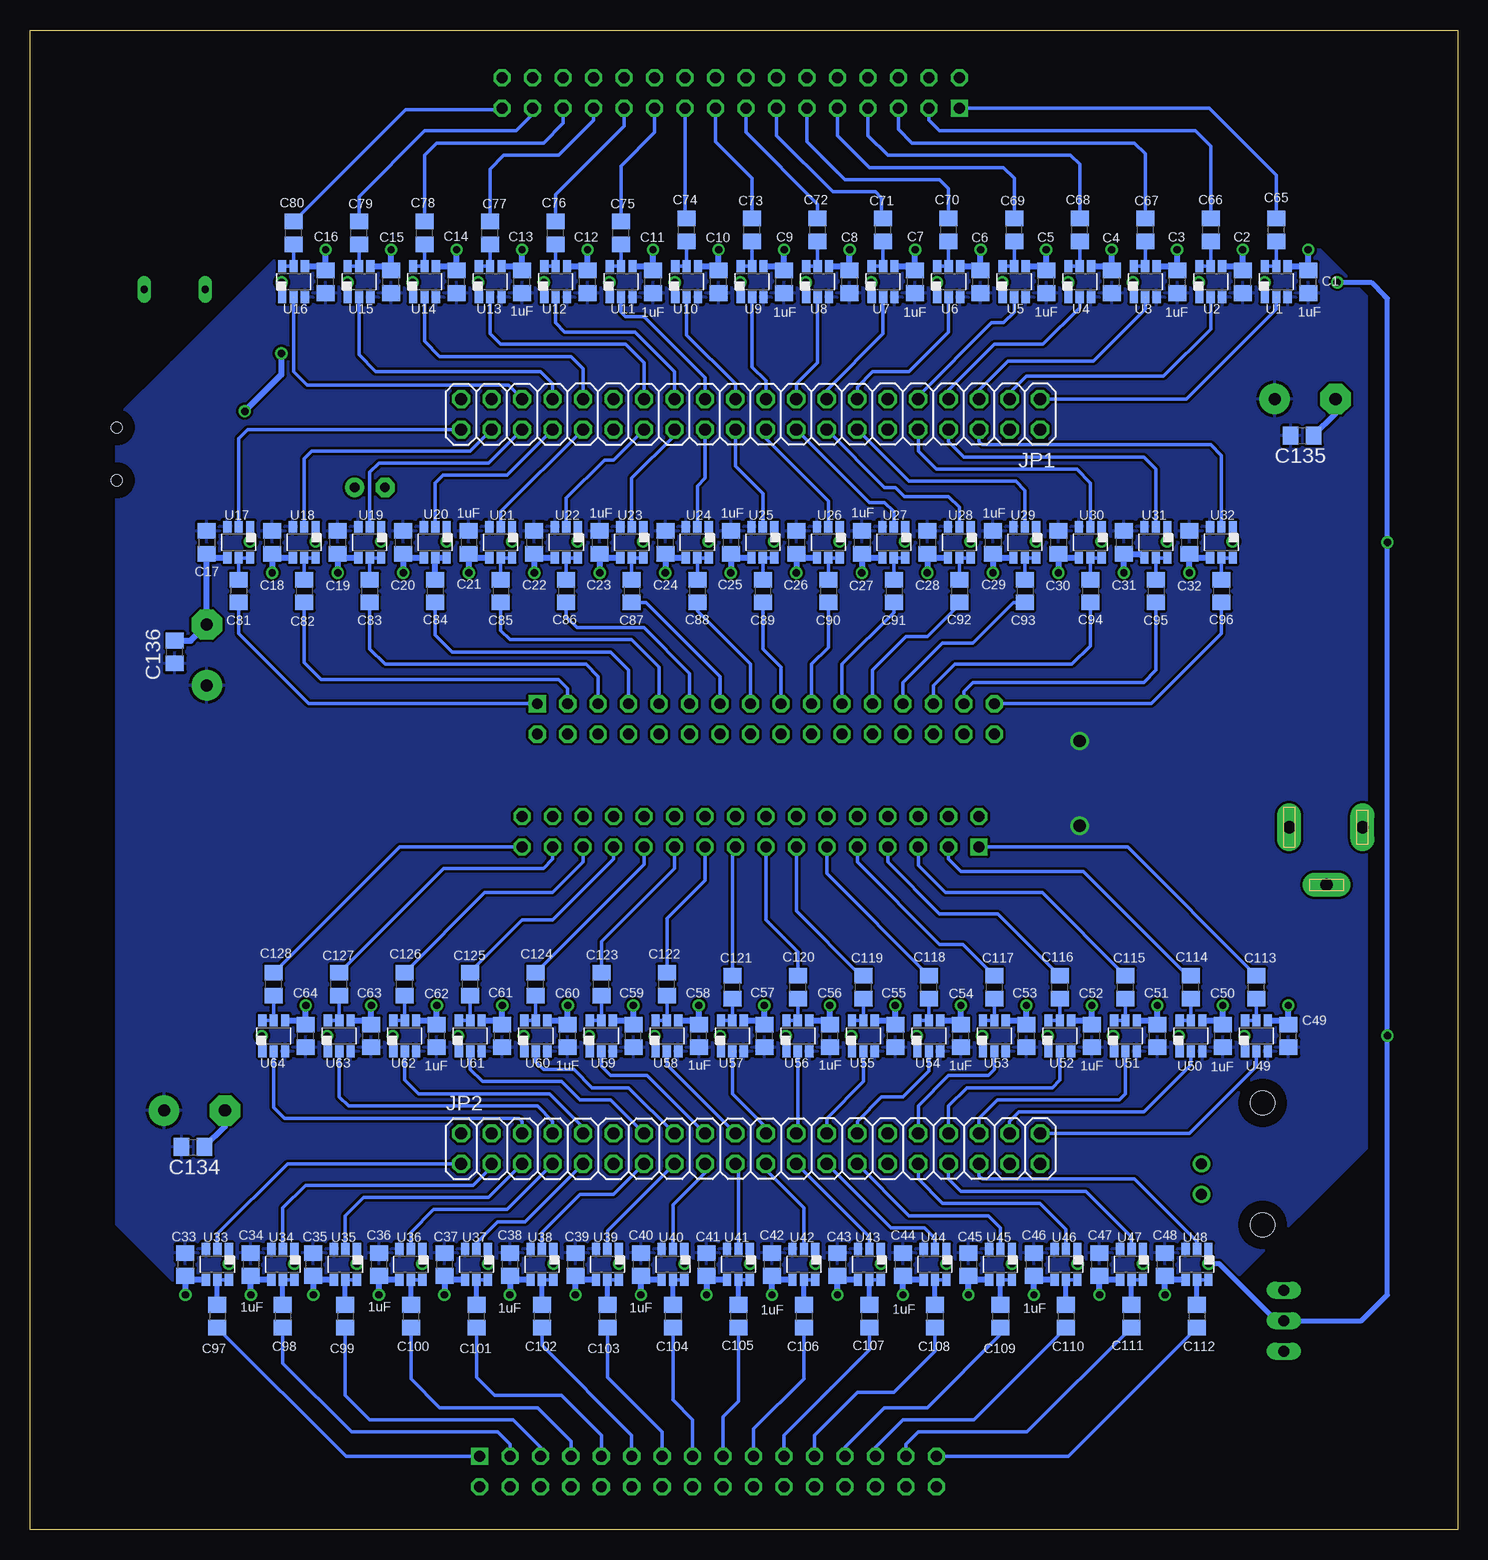
[diagram p6: board, bottom side, seen from below]

Size 119 x 125 mm. Coordinates in mm from the lower left corner, seen from the top.
Outline: 0,0 119,0 119,125 0,125 0,0
Copper layers (1*16): Top 0.035mm / dielectric 1.5mm / Bottom 0.035mm
Design rules "default *": minimum track width 6mil, minimum drill 0.35mm, track to track 8mil, track to pad 8mil, pad to pad 6mil, via to via 8mil, smd to smd 6mil, copper to edge 40mil, drill to drill 6mil, minimum pad ring 10mil, minimum via ring 8mil, stop-mask expansion 4mil, vias tented up to drill 0mil, thermal gap 10mil

### Footprints (pad centres in the part's own frame; a part is rotated, then mirrored left to right if it is on the bottom)
C0805 = smd 1.3 x 1.5: 1 -0.95,0; 2 0.95,0
E5-10,5 = drill 1.016 pad 2.54: + -2.54,0 | drill 1.016 pad 2.54 octagon: - 2.54,0
E2,5-6 = drill 0.813 pad 1.6: + -1.27,0 | drill 0.813 pad 1.6 octagon: - 1.27,0
D0805 = smd 1.2 x 1.2: N 1.05,0; P -1.05,0
DCJ0202 = drill 1.016 pad 2 long: 1 0,3.1; 2 4.8,0; 3 0,-3
2X20 = drill 1.016 octagon: 1 -24.13,-1.27; 2 -24.13,1.27; 3 -21.59,-1.27; 4 -21.59,1.27; 5 -19.05,-1.27; 6 -19.05,1.27; 7 -16.51,-1.27; 8 -16.51,1.27; 9 -13.97,-1.27; 10 -13.97,1.27; 11 -11.43,-1.27; 12 -11.43,1.27; 13 -8.89,-1.27; 14 -8.89,1.27; 15 -6.35,-1.27; 16 -6.35,1.27; 17 -3.81,-1.27; 18 -3.81,1.27; 19 -1.27,-1.27; 20 -1.27,1.27; 21 1.27,-1.27; 22 1.27,1.27; 23 3.81,-1.27; 24 3.81,1.27; 25 6.35,-1.27; 26 6.35,1.27; 27 8.89,-1.27; 28 8.89,1.27; 29 11.43,-1.27; 30 11.43,1.27; 31 13.97,-1.27; 32 13.97,1.27; 33 16.51,-1.27; 34 16.51,1.27; 35 19.05,-1.27; 36 19.05,1.27; 37 21.59,-1.27; 38 21.59,1.27; 39 24.13,-1.27; 40 24.13,1.27
JP2 = drill 0.914 long: 1 -2.54,0; 2 0,0; 3 2.54,0
SML0805 = smd 1.2 x 1.2: A 1.05,0; C -1.05,0
SML1206 = smd 1.5 x 1.5: A 1.75,0; C -1.75,0
QS = drill 0.61 long: 1 -2.54,0; 2 2.54,0
R0805 = smd 1.3 x 1.5: 1 -0.95,0; 2 0.95,0
ML32 = drill 0.914 square: 1 -19.05,-1.27 | drill 0.914 octagon: 2 -19.05,1.27; 3 -16.51,-1.27; 4 -16.51,1.27; 5 -13.97,-1.27; 6 -13.97,1.27; 7 -11.43,-1.27; 8 -11.43,1.27; 9 -8.89,-1.27; 10 -8.89,1.27; 11 -6.35,-1.27; 12 -6.35,1.27; 13 -3.81,-1.27; 14 -3.81,1.27; 15 -1.27,-1.27; 16 -1.27,1.27; 17 1.27,-1.27; 18 1.27,1.27; 19 3.81,-1.27; 20 3.81,1.27; 21 6.35,-1.27; 22 6.35,1.27; 23 8.89,-1.27; 24 8.89,1.27; 25 11.43,-1.27; 26 11.43,1.27; 27 13.97,-1.27; 28 13.97,1.27; 29 16.51,-1.27; 30 16.51,1.27; 31 19.05,-1.27; 32 19.05,1.27
SO8 = smd 0.6 x 2.2: 1 -1.905,-2.6; 2 -0.635,-2.6; 3 0.635,-2.6; 4 1.905,-2.6; 5 1.905,2.6; 6 0.635,2.6; 7 -0.635,2.6; 8 -1.905,2.6
DBV_R-PDSO-G6 = smd 0.69 x 0.99: 1 -0.95,-1.29; 2 0,-1.29; 3 0.95,-1.29; 4 0.95,1.3; 5 0,1.3; 6 -0.95,1.3
TSOT23-8 = smd 0.457 x 1.499: 1 -0.95,-1.3; 2 -0.3,-1.3; 3 0.35,-1.3; 4 1,-1.3; 5 1,1.3; 6 0.35,1.3; 7 -0.3,1.3; 8 -0.95,1.3
SSOP28 = smd 0.4 x 1.5: 1 -4.225,-3.625; 2 -3.575,-3.625; 3 -2.925,-3.625; 4 -2.275,-3.625; 5 -1.625,-3.625; 6 -0.975,-3.625; 7 -0.325,-3.625; 8 0.325,-3.625; 9 0.975,-3.625; 10 1.625,-3.625; 11 2.275,-3.625; 12 2.925,-3.625; 13 3.575,-3.625; 14 4.225,-3.625; 15 4.225,3.625; 16 3.575,3.625; 17 2.925,3.625; 18 2.275,3.625; 19 1.625,3.625; 20 0.975,3.625; 21 0.325,3.625; 22 -0.325,3.625; 23 -0.975,3.625; 24 -1.625,3.625; 25 -2.275,3.625; 26 -2.925,3.625; 27 -3.575,3.625; 28 -4.225,3.625
32005-201 = smd 3.1 x 0.5: 1 3,1.6; 2 3,0.8; 3 3,0; 4 3,-0.8; 5 3,-1.6 | smd 2.5 x 2: M1 -3,-4.45; M2 -3,4.45 | smd 3.3 x 2: M3 2.9,4.45; M4 2.9,-4.45 | hole 0.914: 0,2.2; 0,-2.2
BNC_CUSTOM = drill 0.914 pad 1.27: 1 0,-5.08; 2 -2.54,-5.08 | hole 2: -5.08,0; 5.08,0

### Placement (x,y rotation side)
C1  12.45,104.01 90 bottom
C2  17.91,104.01 90 bottom
C3  23.37,104.01 90 bottom
C4  28.83,104.01 90 bottom
C5  34.29,104.01 90 bottom
C6  39.75,104.01 90 bottom
C7  45.21,104.01 90 bottom
C8  50.67,104.01 90 bottom
C9  56.13,104.01 90 bottom
C10  61.59,104.01 90 bottom
C11  67.06,104.01 90 bottom
C12  72.52,104.01 90 bottom
C13  77.98,104.01 90 bottom
C14  83.44,104.01 90 bottom
C15  88.9,104.01 90 bottom
C16  94.36,104.01 90 bottom
C17  104.27,82.3 270 bottom
C18  98.81,82.3 270 bottom
C19  93.34,82.3 270 bottom
C20  87.88,82.3 270 bottom
C21  82.42,82.3 270 bottom
C22  76.96,82.3 270 bottom
C23  71.5,82.3 270 bottom
C24  66.04,82.3 270 bottom
C25  60.58,82.3 270 bottom
C26  55.12,82.3 270 bottom
C27  49.66,82.3 270 bottom
C28  44.2,82.3 270 bottom
C29  38.73,82.3 270 bottom
C30  33.27,82.3 270 bottom
C31  27.81,82.3 270 bottom
C32  22.35,82.3 270 bottom
C33  106.05,22.1 270 bottom
C34  100.58,22.1 270 bottom
C35  95.38,22.1 270 bottom
C36  89.92,22.1 270 bottom
C37  84.45,22.1 270 bottom
C38  78.99,22.1 270 bottom
C39  73.53,22.1 270 bottom
C40  68.07,22.1 270 bottom
C41  62.61,22.1 270 bottom
C42  57.15,22.1 270 bottom
C43  51.69,22.1 270 bottom
C44  46.23,22.1 270 bottom
C45  40.77,22.1 270 bottom
C46  35.31,22.1 270 bottom
C47  29.84,22.1 270 bottom
C48  24.38,22.1 270 bottom
C49  14.1,41.15 90 bottom
C50  19.56,41.15 90 bottom
C51  25.02,41.15 90 bottom
C52  30.48,41.15 90 bottom
C53  35.94,41.15 90 bottom
C54  41.4,41.15 90 bottom
C55  46.86,41.15 90 bottom
C56  52.32,41.15 90 bottom
C57  57.78,41.15 90 bottom
C58  63.25,41.15 90 bottom
C59  68.71,41.15 90 bottom
C60  74.17,41.15 90 bottom
C61  79.63,41.15 90 bottom
C62  85.09,41.15 90 bottom
C63  90.55,41.15 90 bottom
C64  96.01,41.15 90 bottom
C65  15.11,108.33 90 bottom
C66  20.57,108.33 90 bottom
C67  26.04,108.33 90 bottom
C68  31.5,108.33 90 bottom
C69  36.96,108.33 90 bottom
C70  42.42,108.33 90 bottom
C71  47.88,108.33 90 bottom
C72  53.34,108.33 90 bottom
C73  58.8,108.33 90 bottom
C74  64.26,108.33 90 bottom
C75  69.72,108.08 90 bottom
C76  75.18,108.08 90 bottom
C77  80.64,108.08 90 bottom
C78  86.11,108.08 90 bottom
C79  91.57,108.08 90 bottom
C80  97.03,108.08 90 bottom
C81  101.6,78.23 270 bottom
C82  96.14,78.23 270 bottom
C83  90.68,78.23 270 bottom
C84  85.22,78.23 270 bottom
C85  79.76,78.23 270 bottom
C86  74.3,78.23 270 bottom
C87  68.83,78.23 270 bottom
C88  63.37,78.23 270 bottom
C89  57.91,78.23 270 bottom
C90  52.45,78.23 270 bottom
C91  46.99,78.23 270 bottom
C92  41.53,78.23 270 bottom
C93  36.07,78.23 270 bottom
C94  30.61,78.23 270 bottom
C95  25.15,78.23 270 bottom
C96  19.68,78.23 270 bottom
C97  103.38,17.78 270 bottom
C98  97.92,17.78 270 bottom
C99  92.71,17.78 270 bottom
C100  87.25,17.78 270 bottom
C101  81.79,17.78 270 bottom
C102  76.33,17.78 270 bottom
C103  70.87,17.78 270 bottom
C104  65.41,17.78 270 bottom
C105  59.94,17.78 270 bottom
C106  54.48,17.78 270 bottom
C107  49.02,17.78 270 bottom
C108  43.56,17.78 270 bottom
C109  38.1,17.78 270 bottom
C110  32.64,17.78 270 bottom
C111  27.18,17.78 270 bottom
C112  21.72,17.78 270 bottom
C113  16.76,45.21 90 bottom
C114  22.23,45.21 90 bottom
C115  27.69,45.21 90 bottom
C116  33.15,45.21 90 bottom
C117  38.61,45.21 90 bottom
C118  44.07,45.21 90 bottom
C119  49.53,45.21 90 bottom
C120  54.99,45.21 90 bottom
C121  60.45,45.21 90 bottom
C122  65.91,45.47 90 bottom
C123  71.37,45.47 90 bottom
C124  76.83,45.47 90 bottom
C125  82.3,45.47 90 bottom
C126  87.76,45.47 90 bottom
C127  93.22,45.47 90 bottom
C128  98.68,45.47 90 bottom
C130  105.28,34.92 180 top
C131  12.7,94.23 180 top
C132  104.27,72.9 90 top
C134  105.41,31.88 0 bottom
C135  12.95,91.19 0 bottom
C136  106.93,73.15 90 bottom
C137  105.54,93.73 90 top
C138  96.01,86.61 270 top
C139  104.65,84.84 270 top
C140  104.39,108.2 90 top
C141  109.47,108.2 90 top
C142  90.68,86.87 180 top
D1  100.58,85.6 180 top
J1  10.92,58.55 270 top
JP1  58.93,92.96 180 bottom
JP2  58.93,31.75 0 bottom
JUMPER  14.48,17.4 90 top
L1  103.89,87.88 0 top
L2  98.55,88.65 270 top
LED1  106.4,113.08 0 top
LED2  106.43,115.82 0 top
Q1  106.93,103.38 180 top
R1  25.4,54.99 180 top
R2  17.53,57.28 180 top
R3  19.43,55.12 180 top
R4  20.45,51.94 90 top
R5  102.11,112.01 90 top
R6  101.35,115.82 0 top
SV1  60.58,119.76 0 top
SV2  57.66,67.56 180 top
SV3  62.48,4.83 180 top
SV4  58.93,58.17 0 top
T1  27.69,63.12 0 top
U1  15.11,104.01 0 bottom
U2  20.57,104.01 0 bottom
U3  26.04,104.01 0 bottom
U4  31.5,104.01 0 bottom
U5  36.96,104.01 0 bottom
U6  42.42,104.01 0 bottom
U7  47.88,104.01 0 bottom
U8  53.34,104.01 0 bottom
U9  58.8,104.01 0 bottom
U10  64.26,104.01 0 bottom
U11  69.72,104.01 0 bottom
U12  75.18,104.01 0 bottom
U13  80.64,104.01 0 bottom
U14  86.11,104.01 0 bottom
U15  91.57,104.01 0 bottom
U16  97.03,104.01 0 bottom
U17  101.6,82.3 180 bottom
U18  96.14,82.3 180 bottom
U19  90.68,82.3 180 bottom
U20  85.22,82.3 180 bottom
U21  79.76,82.3 180 bottom
U22  74.3,82.3 180 bottom
U23  68.83,82.3 180 bottom
U24  63.37,82.3 180 bottom
U25  57.91,82.3 180 bottom
U26  52.45,82.3 180 bottom
U27  46.99,82.3 180 bottom
U28  41.53,82.3 180 bottom
U29  36.07,82.3 180 bottom
U30  30.61,82.3 180 bottom
U31  25.15,82.3 180 bottom
U32  19.68,82.3 180 bottom
U33  103.38,22.1 180 bottom
U34  97.92,22.1 180 bottom
U35  92.71,22.1 180 bottom
U36  87.25,22.1 180 bottom
U37  81.79,22.1 180 bottom
U38  76.33,22.1 180 bottom
U39  70.87,22.1 180 bottom
U40  65.41,22.1 180 bottom
U41  59.94,22.1 180 bottom
U42  54.48,22.1 180 bottom
U43  49.02,22.1 180 bottom
U44  43.56,22.1 180 bottom
U45  38.1,22.1 180 bottom
U46  32.64,22.1 180 bottom
U47  27.18,22.1 180 bottom
U48  21.72,22.1 180 bottom
U49  16.76,41.15 0 bottom
U50  22.23,41.15 0 bottom
U51  27.69,41.15 0 bottom
U52  33.15,41.15 0 bottom
U53  38.61,41.15 0 bottom
U54  44.07,41.15 0 bottom
U55  49.53,41.15 0 bottom
U56  54.99,41.15 0 bottom
U57  60.45,41.15 0 bottom
U58  65.91,41.15 0 bottom
U59  71.37,41.15 0 bottom
U60  76.83,41.15 0 bottom
U61  82.3,41.15 0 bottom
U62  87.76,41.15 0 bottom
U63  93.22,41.15 0 bottom
U64  98.68,41.15 0 bottom
U65  24.38,57.66 270 top
U66  99.57,95.76 270 top
X1  111.76,89.66 180 top
X2  16.26,30.48 90 top

### Tracks (layer width: path | path; a pad name or v marks a point on that pad's centre or on a via)
3V3  (via drill 0.61)
  Top 0.305: C137.1 105.48,92.83 U66.17 101.48,92.83 v101.09,93.22 | v98.04,98.04 95.95,98.04 U66.4
  Top 0.406: LED2.A 108.18,117.12 107.7,117.6 99.82,117.6 99.06,116.84 99.06,99.06 v98.04,98.04
  Top 0.61: LED1.A 108.18,113.11 LED2.A
  Bottom 0.508: v98.04,98.04 98.04,96.27 v101.09,93.22
!RXLED!
  Top 0.254: U66.22 100.77,96.08 100.2,96.65 100.2,115.63 | 100.2,115.63 R6.1 100.2,115.63
!TXLED!
  Top 0.254: U66.23 101.64,96.73 101.09,97.28 101.09,108.46 102.11,109.47 R5.1
BNC
  Top 0.406: X2.1 JP2.39
D+
  Top 0.305: U66.15 103.19,90.36 103.89,89.66 X1.3
D-
  Top 0.305: X1.2 102.4,88.86 101.85,89.41 101.85,91.95 102.11,92.2 102.13,92.18 U66.16
ENABLE  (via drill 0.61, 0.61 pad 0.61)
  Top 0.381: v16.08,103.96 v10.03,103.96
  Top 0.406: v16.08,103.96 v21.57,103.96 v27.05,103.96 v32.46,103.96 v37.95,103.96 v43.38,103.96 v48.87,103.96 v54.33,103.96 v59.79,103.96 v65.25,103.96 v70.71,103.96 v76.17,103.96 v81.64,103.96 v87.1,103.96 v92.53,103.96 v98.02,103.96 | v100.66,82.35 v95.2,82.35 v89.74,82.35 v84.28,82.35 v78.82,82.35 v73.36,82.35 v67.89,82.35 v62.43,82.35 v56.97,82.35 v51.51,82.35 v46.05,82.35 v40.59,82.35 v35.13,82.35 v29.67,82.35 v24.21,82.35 v18.75,82.35 5.89,82.35 v5.84,82.3 | v99.69,41.15 v94.23,41.15 v88.77,41.15 v83.31,41.15 v77.85,41.15 v72.39,41.15 v66.93,41.15 v61.47,41.15 v56.01,41.15 v50.55,41.15 v45.09,41.15 v39.62,41.15 v34.16,41.15 v28.7,41.15 v23.24,41.15 v17.78,41.15 17.75,41.17 v5.84,41.17 | v20.75,22.15 v26.21,22.15 v31.67,22.15 v37.13,22.15 v42.6,22.15 v48.06,22.15 v53.52,22.15 v58.98,22.15 v64.44,22.15 v69.9,22.15 v75.36,22.15 v80.82,22.15 v86.28,22.15 v91.75,22.15 v96.95,22.15 v102.41,22.15
  Bottom 0.381: 6.1,102.87 5.84,102.62
  Bottom 0.406: 18.75,83.58 U32.1 | 24.21,83.58 U31.1 | 29.67,83.58 U30.1 | 35.13,83.58 U29.1 | 40.59,83.58 U28.1 | 46.05,83.58 U27.1 | 51.51,83.58 U26.1 | 56.97,83.58 U25.1 | 62.43,83.58 U24.1 | 67.89,83.58 U23.1 | 73.36,83.58 U22.1 | 78.82,83.58 U21.1 | 84.28,83.58 U20.1 | 89.74,83.58 U19.1 | 95.2,83.58 U18.1 | 100.66,83.58 U17.1 | v20.75,22.15 19.86,22.15 15.11,17.4 14.73,17.4 JUMPER.2 8,17.4 5.84,19.56 v5.84,41.17 v5.84,82.3 5.84,102.62 6.1,102.87 7.19,103.96 v10.03,103.96
  Bottom 0.508: U1.1 16.06,103.95 v16.08,103.96 | U2.1 21.52,103.92 v21.57,103.96 | U3.1 26.98,103.9 v27.05,103.96 | U4.1 32.45,103.95 v32.46,103.96 | U5.1 37.91,103.92 v37.95,103.96 | U6.1 43.37,103.95 v43.38,103.96 | U7.1 48.83,103.92 v48.87,103.96 | U8.1 54.33,102.76 v54.33,103.96 | U9.1 59.79,102.76 v59.79,103.96 | U10.1 65.25,102.76 v65.25,103.96 | U11.1 70.71,102.76 v70.71,103.96 | U12.1 76.17,102.76 v76.17,103.96 | U13.1 81.59,103.92 v81.64,103.96 | U14.1 87.06,103.92 v87.1,103.96 | U15.1 92.52,103.95 v92.53,103.96 | U16.1 97.98,103.92 v98.02,103.96 | v100.66,82.35 100.66,83.58 | v95.2,82.35 95.2,83.58 | v89.74,82.35 89.74,83.58 | v84.28,82.35 84.28,83.58 | v78.82,82.35 78.82,83.58 | v73.36,82.35 73.36,83.58 | v67.89,82.35 67.89,83.58 | v62.43,82.35 62.43,83.58 | v56.97,82.35 56.97,83.58 | v51.51,82.35 51.51,83.58 | v46.05,82.35 46.05,83.58 | v40.59,82.35 40.59,83.58 | v35.13,82.35 35.13,83.58 | v29.67,82.35 29.67,83.58 | v24.21,82.35 24.21,83.58 | v18.75,82.35 18.75,83.58 | U54.1 45.02,41.08 v45.09,41.15 | U60.1 77.78,41.08 v77.85,41.15 | U62.1 88.71,41.08 v88.77,41.15 | U63.1 94.17,41.08 v94.23,41.15 | U64.1 99.63,41.08 v99.69,41.15 | U49.1 17.71,41.08 v17.78,41.15 | U50.1 23.18,41.08 v23.24,41.15 | U51.1 28.64,41.08 v28.7,41.15 | U52.1 34.1,41.08 v34.16,41.15 | U53.1 39.56,41.08 v39.62,41.15 | U55.1 50.48,41.08 v50.55,41.15 | U56.1 55.94,41.08 v56.01,41.15 | U57.1 61.4,41.08 v61.47,41.15 | U58.1 66.86,41.08 v66.93,41.15 | U59.1 72.32,41.08 v72.39,41.15 | U61.1 83.25,41.08 v83.31,41.15 | v102.41,22.15 102.41,23.37 U33.1 | U34.1 96.97,22.16 v96.95,22.15 | U35.1 91.75,23.37 v91.75,22.15 | U36.1 86.3,22.16 v86.28,22.15 | U38.1 75.38,22.16 v75.36,22.15
  Bottom 0.508: U39.1 69.92,22.16 v69.9,22.15 | U40.1 64.45,22.16 v64.44,22.15 | U41.1 58.98,23.37 v58.98,22.15 | U42.1 53.53,22.16 v53.52,22.15 | U43.1 48.07,22.16 v48.06,22.15 | U44.1 42.61,22.16 v42.6,22.15 | U45.1 37.15,22.16 v37.13,22.15 | U46.1 31.69,22.16 v31.67,22.15 | U47.1 26.23,22.16 v26.21,22.15 | v20.75,22.15 20.75,23.37 U48.1 | v80.82,22.15 80.82,23.37 U37.1
FPGA-EN
  Top 0.406: JP2.37 37.34,28.96 34.04,25.65 20.57,25.65 14.86,19.94 JUMPER.3
GND  (via drill 0.61 pad 0.61)
  Bottom 0.508: U32.4 22,81 C32.2 v22.35,79.76 | v27.81,79.76 27.81,81.28 | 27.81,81.28 C31.2 | U31.4 26.38,81.28 27.81,81.28 | U30.4 32.92,81 C30.2 v33.27,79.76 | U29.4 38.38,81 C29.2 v38.73,79.76 | U28.4 43.85,81 C28.2 v44.2,79.76 | U27.4 49.31,81 C27.2 v49.66,79.76 | U26.4 54.77,81 C26.2 v55.12,79.76 | U25.4 60.23,81 C25.2 v60.58,79.76 | U24.4 65.69,81 C24.2 v66.04,79.76 | U23.4 71.15,81 C23.2 v71.5,79.76 | U22.4 76.61,81 C22.2 v76.96,79.76 | U21.4 82.07,81 C21.2 v82.42,79.76 | U20.4 87.53,81 C20.2 v87.88,79.76 | U19.4 93,81 C19.2 v93.34,79.76 | U18.4 98.46,81 C18.2 v98.81,79.76 | U17.4 103.92,81 C17.2 C132.- 105.6,74.1 C136.2 | C135.2 10.16,93.03 C131.- | C134.2 102.74,33.59 C130.- | U1.4 12.8,105.31 C1.2 v12.45,106.68 | C2.2 17.91,105.16 | 17.91,105.16 v17.91,106.68 | U2.4 18.06,105.31 17.91,105.16 | U3.4 23.72,105.31 C3.2 v23.37,106.68 | U4.4 29.18,105.31 C4.2 v28.83,106.68 | U5.4 34.64,105.31 C5.2 v34.29,106.68 | U6.4 40.1,105.31 C6.2 v39.75,106.68 | U7.4 45.56,105.31 C7.2 v45.21,106.68 | U8.4 51.02,105.31 C8.2 v50.67,106.68 | U9.4 56.48,105.31 C9.2 v56.13,106.68 | U10.4 61.95,105.31 C10.2 v61.59,106.68 | U11.4 67.41,105.31 C11.2 v67.06,106.68 | U12.4 72.87,105.31 C12.2 v72.52,106.68 | U13.4 78.33,105.31 C13.2 v77.98,106.68 | U14.4 83.79,105.31 C14.2 v83.44,106.68 | U15.4 89.25,105.31 C15.2 v88.9,106.68 | U16.4 94.71,105.31 C16.2 v94.36,106.68 | U49.4 14.45,42.45 C49.2 v14.1,43.69 | U50.4 19.91,42.45 C50.2 v19.56,43.69 | U51.4 25.37,42.45 C51.2 v25.02,43.69 | U52.4 30.83,42.45 C52.2 v30.48,43.69 | U53.4 36.29,42.45 C53.2 v35.94,43.69 | U54.4 41.75,42.45 C54.2 v41.4,43.69 | U55.4 47.21,42.45 C55.2 v46.86,43.69 | U56.4 52.67,42.45 C56.2 v52.32,43.69
  Bottom 0.508: U57.4 58.13,42.45 C57.2 v57.78,43.69 | U58.4 63.6,42.45 C58.2 v63.25,43.69 | U59.4 69.06,42.45 C59.2 v68.71,43.69 | U60.4 74.52,42.45 C60.2 v74.17,43.69 | U61.4 79.98,42.45 C61.2 v79.63,43.69 | U62.4 85.44,42.45 C62.2 v85.09,43.69 | U63.4 90.9,42.45 C63.2 v90.55,43.69 | U64.4 96.36,42.45 C64.2 v96.01,43.69 | U48.4 24.03,20.8 C48.2 v24.38,19.56 | U47.4 29.5,20.8 C47.2 v29.84,19.56 | U46.4 34.96,20.8 35.15,20.99 | 35.15,20.99 C46.2 | v35.31,19.56 35.31,20.83 35.15,20.99 | U45.4 40.42,20.8 C45.2 v40.77,19.56 | U44.4 45.88,20.8 46.07,20.99 | 46.07,20.99 C44.2 | v46.23,19.56 46.23,20.83 46.07,20.99 | U43.4 51.34,20.8 C43.2 v51.69,19.56 | U42.4 56.8,20.8 56.99,20.99 | 56.99,20.99 C42.2 | v57.15,19.56 57.15,20.83 56.99,20.99 | U41.4 62.26,20.8 C41.2 v62.61,19.56 | U40.4 67.72,20.8 C40.2 v68.07,19.56 | U39.4 73.18,20.8 73.44,21.05 | 73.44,21.05 C39.2 | v73.53,19.56 73.53,20.95 73.44,21.05 | U38.4 78.64,20.8 C38.2 v78.99,19.56 | U37.4 84.11,20.8 C37.2 v84.45,19.56 | U36.4 89.57,20.8 C36.2 v89.92,19.56 | U35.4 95.03,20.8 C35.2 v95.38,19.56 | U34.4 100.23,20.8 C34.2 v100.58,19.56 | U33.4 105.69,20.8 C33.2 v106.05,19.56
  pour Top: 0,0 119.11,0 119.11,124.73 0,124.73
IN0
  Bottom 0.305: U1.2 15.11,101.73 22.61,94.23 JP1.1
IN1
  Bottom 0.305: JP1.3 37.34,94.74 35.94,96.14 24.51,96.14 20.57,100.08 U2.2
IN2
  Bottom 0.305: JP1.5 39.88,95 37.47,97.41 30.35,97.41 26.04,101.73 U3.2
IN3
  Bottom 0.305: JP1.7 42.42,95 38.61,98.81 34.54,98.81 31.5,101.85 U4.2
IN4
  Bottom 0.305: JP1.9 44.96,94.49 38.86,100.58 37.85,100.58 36.96,101.47 36.96,101.6 U5.2
IN5
  Bottom 0.305: U6.2 42.42,99.82 45.72,96.52 48.77,96.52 50.04,95.25 JP1.13
IN6
  Bottom 0.305: U7.2 47.88,99.69 52.58,95 JP1.15
IN7
  Bottom 0.305: JP1.17 55.12,95.5 53.34,97.28 U8.2
IN8
  Bottom 0.305: JP1.19 57.66,95.76 58.8,96.9 U9.2
IN9
  Bottom 0.305: U10.2 64.26,99.57 60.2,95.5 JP1.21
IN10
  Bottom 0.305: JP1.23 62.74,96.01 67.82,101.09 69.34,101.09 69.72,101.47 U11.2
IN11
  Bottom 0.305: U12.2 75.18,100.58 74.42,99.82 68.58,99.82 65.28,96.52 JP1.25
IN12
  Bottom 0.305: U13.2 80.64,99.69 79.76,98.81 69.34,98.81 67.82,97.28 JP1.27
IN13
  Bottom 0.305: U14.2 86.11,99.06 84.84,97.79 73.91,97.79 72.9,96.77 JP1.31
IN14
  Bottom 0.305: U15.2 91.57,97.92 90.17,96.52 76.45,96.52 75.44,95.5 JP1.33
IN15
  Bottom 0.305: U16.2 97.03,96.52 95.89,95.38 79.12,95.38 JP1.35
IN16
  Bottom 0.305: U17.2 101.6,90.93 100.84,91.69 JP1.40
IN17
  Bottom 0.305: U18.2 96.14,89.28 95.5,89.92 82.3,89.92 JP1.38
IN18
  Bottom 0.305: U19.2 90.68,88.14 89.92,88.9 80.77,88.9 JP1.36
IN19
  Bottom 0.305: U20.2 85.22,87.25 84.58,87.88 79.25,87.88 JP1.34
IN20
  Bottom 0.305: U21.2 79.76,84.84 JP1.32
IN21
  Bottom 0.305: U22.2 74.3,85.98 71.12,89.15 70.36,89.15 JP1.28
IN22
  Bottom 0.305: U23.2 68.83,87.63 65.28,91.19 JP1.26
IN23
  Bottom 0.305: U24.2 63.37,87 62.74,87.63 JP1.24
IN24
  Bottom 0.305: U25.2 57.91,86.36 60.2,88.65 JP1.22
IN25
  Bottom 0.305: U26.2 52.45,85.72 57.66,90.93 JP1.20
IN26
  Bottom 0.305: JP1.18 49.02,85.6 47.75,85.6 46.99,84.84 U27.2
IN27
  Bottom 0.305: U28.2 41.53,85.22 42.42,86.11 46.1,86.11 46.86,86.87 47.75,86.87 JP1.16
IN28
  Bottom 0.305: U29.2 36.07,86.61 36.83,87.38 45.72,87.38 JP1.14
IN29
  Bottom 0.305: U30.2 30.61,87.25 31.75,88.39 43.43,88.39 44.96,89.92 JP1.10
IN30
  Bottom 0.305: U31.2 25.15,88.39 26.16,89.41 41.15,89.41 42.42,90.68 JP1.8
IN31
  Bottom 0.305: U32.2 19.68,89.53 20.57,90.42 39.62,90.42 39.88,90.68 JP1.6
IN32
  Bottom 0.305: JP2.1 97.54,30.48 103.38,24.64 U33.2
IN33
  Bottom 0.305: JP2.3 80.52,30.23 82.04,28.7 96.01,28.7 97.92,26.8 U34.2
IN34
  Bottom 0.305: JP2.5 80.77,27.69 91.19,27.69 92.71,26.16 U35.2
IN35
  Bottom 0.305: JP2.7 79.25,26.67 85.34,26.67 87.25,24.77 U36.2
IN36
  Bottom 0.305: JP2.9 77.72,25.65 80.01,25.65 81.79,23.88 U37.2
IN37
  Bottom 0.305: JP2.13 70.36,27.94 73.15,27.94 76.33,24.77 U38.2
IN38
  Bottom 0.305: JP2.15 70.87,24.89 U39.2
IN39
  Bottom 0.305: JP2.17 62.74,29.72 65.41,27.05 U40.2
IN40
  Bottom 0.305: U41.2 59.94,30.23 JP2.19
IN41
  Bottom 0.305: JP2.21 57.66,29.97 54.48,26.8 U42.2
IN42
  Bottom 0.305: U43.2 49.02,24.38 JP2.23
IN43
  Bottom 0.305: JP2.25 47.24,25.15 44.45,25.15 43.56,24.26 U44.2
IN44
  Bottom 0.305: JP2.27 45.72,26.16 39.12,26.16 38.1,25.15 U45.2
IN45
  Bottom 0.305: JP2.31 44.96,29.21 42.93,27.18 34.8,27.18 32.64,25.02 U46.2
IN46
  Bottom 0.305: JP2.33 42.42,29.21 41.4,28.19 30.99,28.19 27.18,24.38 U47.2
IN47
  Bottom 0.305: JP2.35 39.88,29.46 39.62,29.21 26.92,29.21 21.72,24 U48.2
IN48
  Bottom 0.305: JP2.40 22.35,33.02 16.76,38.61 U49.2
IN49
  Bottom 0.305: JP2.38 37.34,34.04 36.58,34.8 26.16,34.8 22.23,38.73 U50.2
IN50
  Bottom 0.305: JP2.36 39.88,34.29 38.35,35.81 28.19,35.81 27.69,36.32 U51.2
IN51
  Bottom 0.305: JP2.34 42.42,35.31 40.89,36.83 33.78,36.83 33.15,37.47 U52.2
IN52
  Bottom 0.305: JP2.32 44.96,35.31 42.42,37.85 39.12,37.85 38.61,38.35 U53.2
IN53
  Bottom 0.305: JP2.28 50.04,34.04 48.01,36.07 46.23,36.07 44.07,38.23 U54.2
IN54
  Bottom 0.305: JP2.26 52.58,34.29 49.53,37.34 U55.2
IN55
  Bottom 0.305: U56.2 54.99,33.15 JP2.24
IN56
  Bottom 0.305: JP2.22 57.66,33.53 60.45,36.32 U57.2
IN57
  Bottom 0.305: JP2.20 65.91,38.73 U58.2
IN58
  Bottom 0.305: JP2.18 67.56,37.85 70.61,37.85 71.37,38.61 U59.2
IN59
  Bottom 0.305: JP2.16 69.09,36.83 72.14,36.83 73.66,38.35 76.2,38.35 76.83,38.99 U60.2
IN60
  Bottom 0.305: JP2.14 70.61,35.81 73.15,35.81 74.68,37.34 81.28,37.34 82.3,38.35 U61.2
IN61
  Bottom 0.305: JP2.10 72.9,33.53 75.69,36.32 86.61,36.32 87.76,37.47 U62.2
IN62
  Bottom 0.305: U63.2 93.22,36.07 92.46,35.31 76.71,35.31 75.44,34.04 JP2.8
IN63
  Bottom 0.305: JP2.6 77.98,34.04 78.23,34.29 97.79,34.29 98.68,35.18 U64.2
N$1
  Bottom 0.305: U1.6 U1.5 C65.1
N$2
  Top 0.406: D1.N 99.53,86.61 L2.A
N$3
  Top 0.406: D1.P 101.63,86.68 L1.C
N$4
  Top 0.305: R1.1 26.35,55.99 U65.5
N$5
  Bottom 0.305: U2.6 U2.5 C66.1
N$6
  Top 0.305: R2.1 18.54,57.28 19.56,57.28 20.24,57.96 U65.2
  Top 0.508: R3.2 18.48,57.22 18.54,57.28
N$7
  Top 0.305: 20.45,55.05 R3.1 20.38,56.58 21.11,57.31 U65.3
  Top 0.508: R4.2 20.45,55.05
N$8
  Bottom 0.305: U3.6 U3.5 C67.1
N$9
  Top 0.305: T1.1 25.78,61.98 26.16,62.36 27.94,62.36 28.32,61.98 T1.3
N$10
  Top 0.305: U65.8 26.73,58.61 | T1.2 27.05,58.93 26.73,58.61 | T1.4 29.59,58.93 29.27,58.61 26.73,58.61
N$11
  Bottom 0.305: U4.6 U4.5 C68.1
N$12
  Top 0.61: R5.2 102.22,113.08 LED1.C
N$13
  Top 0.61: R6.2 LED2.C
N$14
  Bottom 0.305: U5.6 U5.5 C69.1
N$17
  Bottom 0.305: U6.6 U6.5 C70.1
N$20
  Bottom 0.305: U7.6 U7.5 C71.1
N$23
  Bottom 0.305: U8.6 U8.5 C72.1
N$26
  Bottom 0.305: U9.6 U9.5 C73.1
N$29
  Bottom 0.305: U10.6 U10.5 C74.1
N$32
  Bottom 0.305: U11.6 U11.5 C75.1
N$35
  Bottom 0.305: U12.6 U12.5 C76.1
N$38
  Bottom 0.305: U13.6 U13.5 C77.1
N$41
  Bottom 0.305: U14.6 U14.5 C78.1
N$44
  Bottom 0.305: U15.6 U15.5 C79.1
N$47
  Bottom 0.305: U16.6 U16.5 C80.1
N$50
  Bottom 0.305: U17.6 U17.5 C81.1
N$53
  Bottom 0.305: U18.6 U18.5 C82.1
N$56
  Bottom 0.305: U19.6 U19.5 C83.1
N$59
  Bottom 0.508: C84.1 U20.5 U20.6
N$62
  Bottom 0.305: U21.6 U21.5 C85.1
N$65
  Bottom 0.305: U22.6 U22.5 C86.1
N$68
  Bottom 0.305: U23.6 U23.5 C87.1
N$71
  Bottom 0.305: U24.6 U24.5 C88.1
N$74
  Bottom 0.305: U25.6 U25.5 C89.1
N$77
  Bottom 0.305: U26.6 U26.5 C90.1
N$80
  Bottom 0.305: U27.6 U27.5 C91.1
N$83
  Bottom 0.305: U28.6 U28.5 C92.1
N$86
  Bottom 0.305: U29.6 U29.5 C93.1
N$89
  Bottom 0.305: U30.6 U30.5 C94.1
N$92
  Bottom 0.305: U31.6 U31.5 C95.1
N$95
  Bottom 0.305: U32.6 U32.5 C96.1
N$98
  Bottom 0.305: U33.5 U33.6
  Bottom 0.406: C97.1 U33.5
N$101
  Bottom 0.305: U34.5 U34.6
  Bottom 0.406: C98.1 U34.5
N$104
  Bottom 0.305: U35.5 U35.6
  Bottom 0.406: C99.1 U35.5
N$107
  Bottom 0.305: U36.5 U36.6
  Bottom 0.406: C100.1 U36.5
N$110
  Bottom 0.305: U37.5 U37.6
  Bottom 0.406: C101.1 U37.5
N$113
  Bottom 0.305: U38.5 U38.6
  Bottom 0.406: C102.1 U38.5
N$116
  Bottom 0.305: U39.5 U39.6
  Bottom 0.406: C103.1 U39.5
N$119
  Bottom 0.305: U40.5 U40.6
  Bottom 0.406: C104.1 U40.5
N$122
  Bottom 0.305: U41.5 U41.6
  Bottom 0.406: C105.1 U41.5
N$125
  Bottom 0.305: U42.5 U42.6
  Bottom 0.406: C106.1 U42.5
N$128
  Bottom 0.305: U43.5 U43.6
  Bottom 0.406: C107.1 U43.5
N$131
  Bottom 0.305: U44.5 U44.6
  Bottom 0.406: C108.1 U44.5
N$134
  Bottom 0.305: U45.5 U45.6
  Bottom 0.406: C109.1 U45.5
N$137
  Bottom 0.305: U46.6 U46.5
  Bottom 0.406: C110.1 U46.5
N$140
  Bottom 0.305: U47.5 U47.6
  Bottom 0.406: C111.1 U47.5
N$143
  Bottom 0.305: U48.5 U48.6
  Bottom 0.406: C112.1 U48.5
N$146
  Bottom 0.305: U49.6 U49.5 C113.1
N$149
  Bottom 0.305: U50.6 U50.5 C114.1
N$152
  Bottom 0.305: U51.6 U51.5 C115.1
N$155
  Bottom 0.305: U52.6 U52.5 C116.1
N$158
  Bottom 0.305: U53.6 U53.5 C117.1
N$161
  Bottom 0.305: U54.6 U54.5 C118.1
N$164
  Bottom 0.305: U55.6 U55.5 C119.1
N$167
  Bottom 0.305: U56.6 U56.5 C120.1
N$170
  Bottom 0.305: U57.6 U57.5 C121.1
N$173
  Bottom 0.305: U58.6 U58.5 C122.1
N$176
  Bottom 0.305: U59.6 U59.5 C123.1
N$179
  Bottom 0.305: U60.6 U60.5 C124.1
N$182
  Bottom 0.305: U61.6 U61.5 C125.1
N$185
  Bottom 0.305: U62.6 U62.5 C126.1
N$188
  Bottom 0.305: U63.6 U63.5 C127.1
N$191
  Bottom 0.305: U64.6 U64.5 C128.1
OSCI
  Top 0.305: U66.27 105.43,99.33 Q1.1
  Top 0.508: Q1.1 C141.1
OSCO
  Top 0.305: U66.28 103.19,102.18 Q1.2
  Top 0.508: Q1.2 C140.1
OUT0
  Bottom 0.305: SV1.1 20.7,118.49 15.11,112.9 C65.2
OUT1
  Bottom 0.305: SV1.3 44.07,117.47 43.18,116.59 21.84,116.59 20.83,115.57 20.57,115.32 C66.2
OUT2
  Bottom 0.305: SV1.5 46.61,116.71 45.47,115.57 26.92,115.57 26.04,114.68 C67.2
OUT3
  Bottom 0.305: SV1.7 49.15,116.2 47.5,114.55 32.26,114.55 31.5,113.79 C68.2
OUT4
  Bottom 0.305: SV1.9 51.69,116.2 49.02,113.54 37.85,113.54 36.96,112.65 C69.2
OUT5
  Bottom 0.305: SV1.11 54.23,115.7 51.05,112.52 43.18,112.52 42.42,111.76 C70.2
OUT6
  Bottom 0.305: SV1.13 56.77,116.2 52.07,111.51 48.51,111.51 48.01,111 48.01,109.41 C71.2
OUT7
  Bottom 0.305: SV1.15 59.31,116.46 53.34,110.49 C72.2
OUT8
  Bottom 0.305: SV1.17 61.85,115.7 58.8,112.65 C73.2
OUT9
  Bottom 0.305: C74.2 64.39,109.41 SV1.19
OUT10
  Bottom 0.305: SV1.21 66.93,116.46 69.72,113.67 C75.2
OUT11
  Bottom 0.305: SV1.23 69.47,116.97 75.18,111.25 C76.2
OUT12
  Bottom 0.305: SV1.25 72.01,117.47 74.93,114.55 79.5,114.55 80.64,113.41 C77.2
OUT13
  Bottom 0.305: SV1.27 74.55,117.22 76.2,115.57 85.09,115.57 85.98,114.68 86.11,114.55 C78.2
OUT14
  Bottom 0.305: SV1.29 77.09,117.98 78.49,116.59 86.11,116.59 91.57,111.12 C79.2
OUT15
  Bottom 0.305: SV1.31 79.76,118.36 87.69,118.36 C80.2
OUT16
  Bottom 0.305: C81.2 101.6,74.68 95.76,68.83 SV2.1
OUT17
  Bottom 0.305: C82.2 96.14,72.26 94.74,70.87 74.93,70.87 74.17,70.1 SV2.3
OUT18
  Bottom 0.305: C83.2 90.68,73.41 89.41,72.14 72.64,72.14 71.63,71.12 SV2.5
OUT19
  Bottom 0.305: C84.2 85.22,74.55 83.82,73.15 70.61,73.15 69.09,71.63 SV2.7
OUT20
  Bottom 0.305: C85.2 79.76,74.93 78.99,74.17 68.83,74.17 66.55,71.88 SV2.9
OUT21
  Bottom 0.305: C86.2 74.3,76.07 73.41,75.18 67.82,75.18 64.01,71.37 SV2.11
OUT22
  Bottom 0.305: SV2.13 61.47,71.12 67.63,77.28 C87.2
OUT23
  Bottom 0.305: C88.2 63.37,76.58 58.93,72.14 SV2.15
OUT24
  Bottom 0.305: C89.2 57.91,73.41 56.39,71.88 SV2.17
OUT25
  Bottom 0.305: C90.2 52.45,73.53 53.85,72.14 SV2.19
OUT26
  Bottom 0.305: C91.2 46.99,76.45 51.31,72.14 SV2.21
OUT27
  Bottom 0.305: C92.2 41.53,77.09 44.2,74.42 45.97,74.42 48.77,71.63 SV2.23
OUT28
  Bottom 0.305: SV2.25 46.23,70.61 42.93,73.91 40.39,73.91 37.02,77.28 C93.2
OUT29
  Bottom 0.305: C94.2 30.61,73.66 32.13,72.14 41.91,72.14 43.69,70.36 SV2.27
OUT30
  Bottom 0.305: C95.2 25.15,71.63 26.16,70.61 40.39,70.61 41.15,69.85 SV2.29
OUT31
  Bottom 0.305: C96.2 19.68,74.68 25.53,68.83 SV2.31
OUT32
  Bottom 0.305: SV3.1 92.64,6.1 C97.2
OUT33
  Bottom 0.305: SV3.3 78.99,7.11 80.01,8.13 92.2,8.13 97.92,13.84 C98.2
OUT34
  Bottom 0.305: SV3.5 76.45,6.86 78.74,9.14 90.68,9.14 92.71,11.18 C99.2
OUT35
  Bottom 0.305: SV3.7 73.91,7.37 76.71,10.16 84.84,10.16 87.25,12.57 C100.2
OUT36
  Bottom 0.305: SV3.9 71.37,7.87 74.68,11.18 80.26,11.18 81.79,12.7 C101.2
OUT37
  Bottom 0.305: SV3.11 68.83,7.87 76.33,15.37 C102.2
OUT38
  Bottom 0.305: SV3.13 66.29,8.13 70.87,12.7 C103.2
OUT39
  Bottom 0.305: SV3.15 63.75,9.14 65.41,10.79 C104.2
OUT40
  Bottom 0.305: SV3.17 61.21,9.4 59.94,10.67 C105.2
OUT41
  Bottom 0.305: SV3.19 58.67,8.38 54.48,12.57 C106.2
OUT42
  Bottom 0.305: SV3.21 56.13,7.87 49.02,14.99 C107.2
OUT43
  Bottom 0.305: SV3.23 53.59,7.87 50.04,11.43 46.99,11.43 43.56,14.86 C108.2
OUT44
  Bottom 0.305: SV3.25 51.05,6.86 47.75,10.16 44.2,10.16 38.1,16.26 C109.2
OUT45
  Bottom 0.305: SV3.27 48.51,6.86 46.23,9.14 40.33,9.14 C110.2
OUT46
  Bottom 0.305: SV3.29 45.97,7.11 44.96,8.13 35.88,8.13 C111.2
OUT47
  Bottom 0.305: SV3.31 32.45,6.1 C112.2
OUT48
  Bottom 0.305: SV4.1 27.5,56.9 C113.2
OUT49
  Bottom 0.305: SV4.3 42.42,55.88 41.4,54.86 31.18,54.86 22.48,46.16 C114.2
OUT50
  Bottom 0.305: SV4.5 44.96,55.37 42.67,53.09 34.61,53.09 C115.2
OUT51
  Bottom 0.305: SV4.7 47.5,55.63 43.18,51.31 38.29,51.31 C116.2
OUT52
  Bottom 0.305: SV4.9 50.04,55.63 43.18,48.77 41.21,48.77 C117.2
OUT53
  Bottom 0.305: SV4.11 52.58,54.67 C118.2
OUT54
  Bottom 0.305: SV4.13 55.12,51.56 49.72,46.16 C119.2
OUT55
  Bottom 0.305: SV4.15 57.66,50.8 54.99,48.13 C120.2
OUT56
  Bottom 0.305: SV4.17 60.45,56.64 C121.2
OUT57
  Bottom 0.305: SV4.19 62.74,54.1 65.91,50.93 C122.2
OUT58
  Bottom 0.305: SV4.21 65.28,55.12 71.37,49.02 C123.2
OUT59
  Bottom 0.305: SV4.23 67.82,55.43 C124.2
OUT60
  Bottom 0.305: SV4.25 70.36,55.88 75.44,50.8 77.98,50.8 82.3,46.48 C125.2
OUT61
  Bottom 0.305: SV4.27 72.9,55.63 75.44,53.09 81.09,53.09 C126.2
OUT62
  Bottom 0.305: SV4.29 75.44,55.88 76.2,55.12 84.52,55.12 C127.2
OUT63
  Bottom 0.305: SV4.31 88.2,56.9 C128.2
RX
  Top 0.305: JP1.39 88.65,94.23 91.8,97.38 U66.5
TX
  Top 0.305: U66.1 89.82,99.98 85.85,96.01 82.3,96.01 JP1.37
VBUS
  Top 0.254: X1.1 105.11,88.06 L1.A
  Top 0.381: L1.A 104.65,87.6 C139.1
VCC
  Top 0.305: U66.20 99.86,94.78 98.55,93.47 L2.C 97.06,89.7 96.01,88.65 C138.1
  Top 0.406: C142.+ 92.64,87.56 C138.1
VDD  (via drill 1.02, 1.02 pad 0.61)
  Top 0.406: U65.7 30.78,57.96 v31.5,58.67
  Top 0.61: T1.6 T1.5
  Top 1.016: T1.5 31.48,65.72 v31.5,65.73
  pour Bottom: 11.43,106.68 7.62,102.87 7.62,31.75 19.05,20.32 20.32,20.32 105.41,20.32 106.68,20.32 111.76,25.4 111.76,67.31 111.76,74.93 111.76,92.71 107.19,97.28 99.06,105.41 97.79,106.68
VIN
  Top 0.305: U65.1 16.06,58.61 16,58.55 | U65.1 23.13,58.56 23.98,58.56 24.45,58.09 R1.2 | T1.8 24.19,65.72 23.11,64.64 23.11,58.64 U65.1
  Top 0.381: R2.2 16.58,57.97 16,58.55 | T1.7 T1.8
  Top 0.508: J1.1 16,58.55

### Text on the board
tPlace: RX | CH0 | CH15 | TX | CH31 | CH16 | CH48 | CH63 | FPGA | ENABLE | GND | CH47 | CH32
bPlace: 1uF | 1uF | 1uF | 1uF | 1uF | 1uF | 1uF | 1uF | 1uF | 1uF | 1uF | 1uF | 1uF | 1uF | 1uF | 1uF | 1uF | 1uF | 1uF | 1uF | 1uF | 1uF | 1uF | 1uF | 1uF | 1uF
tDocu: Shield / v 0.9